# EAGLE board tc08-8-07 (EAGLE 6.6.0), part 1 of 10
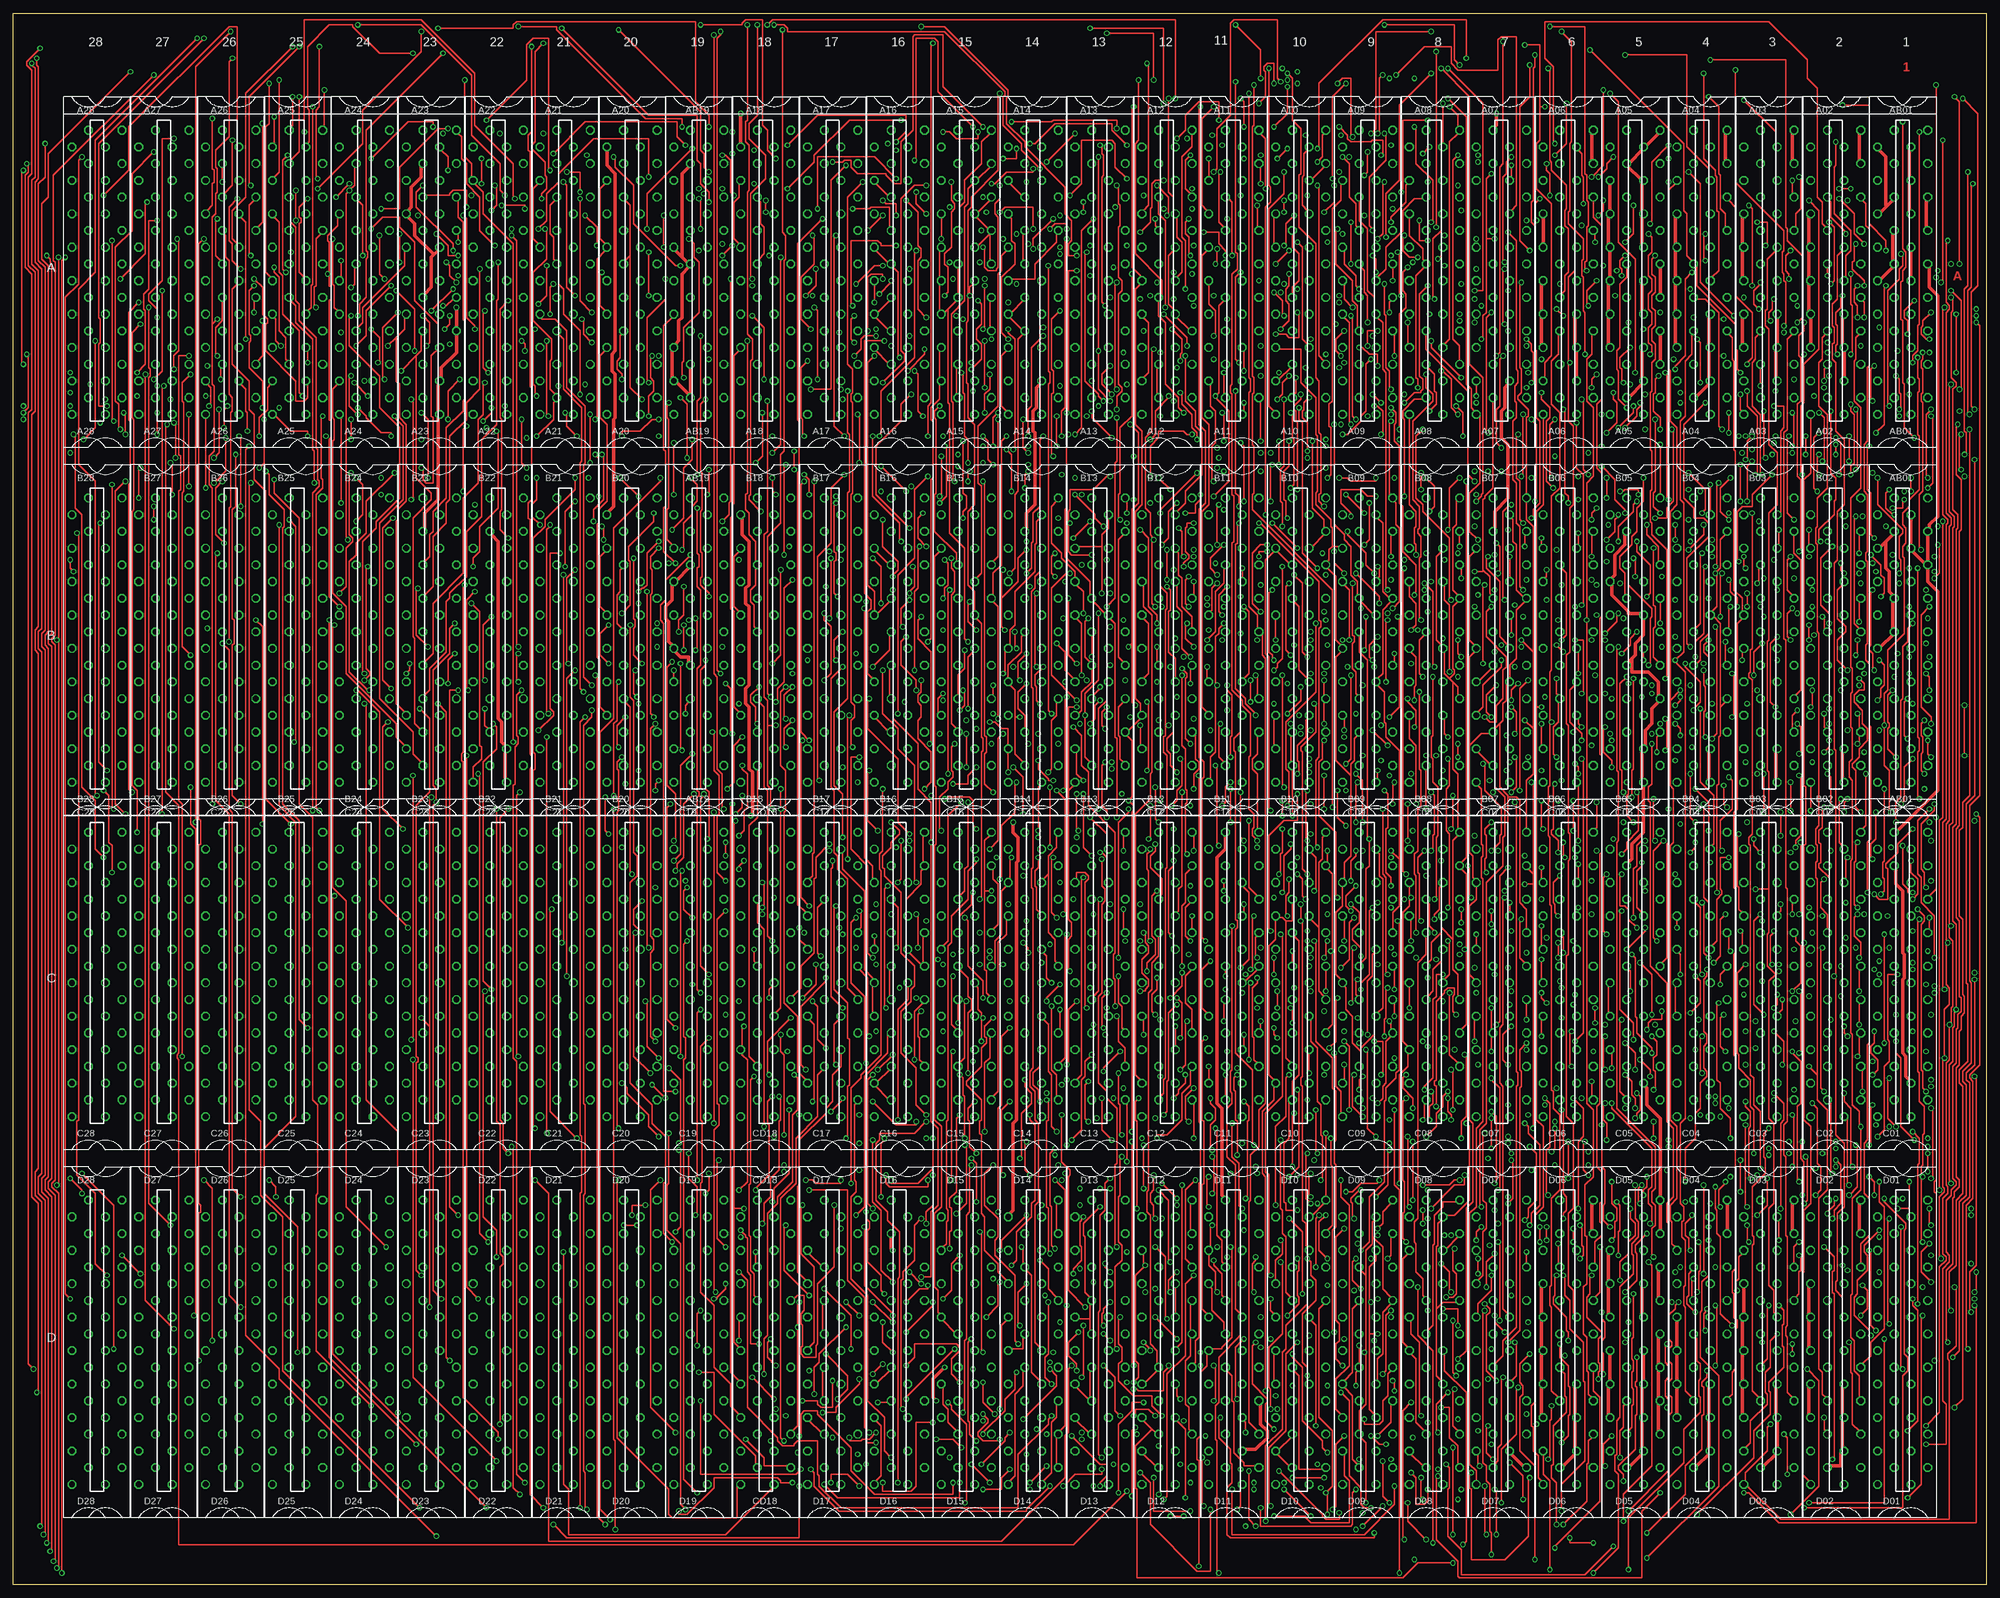
[diagram p12: board, top side]
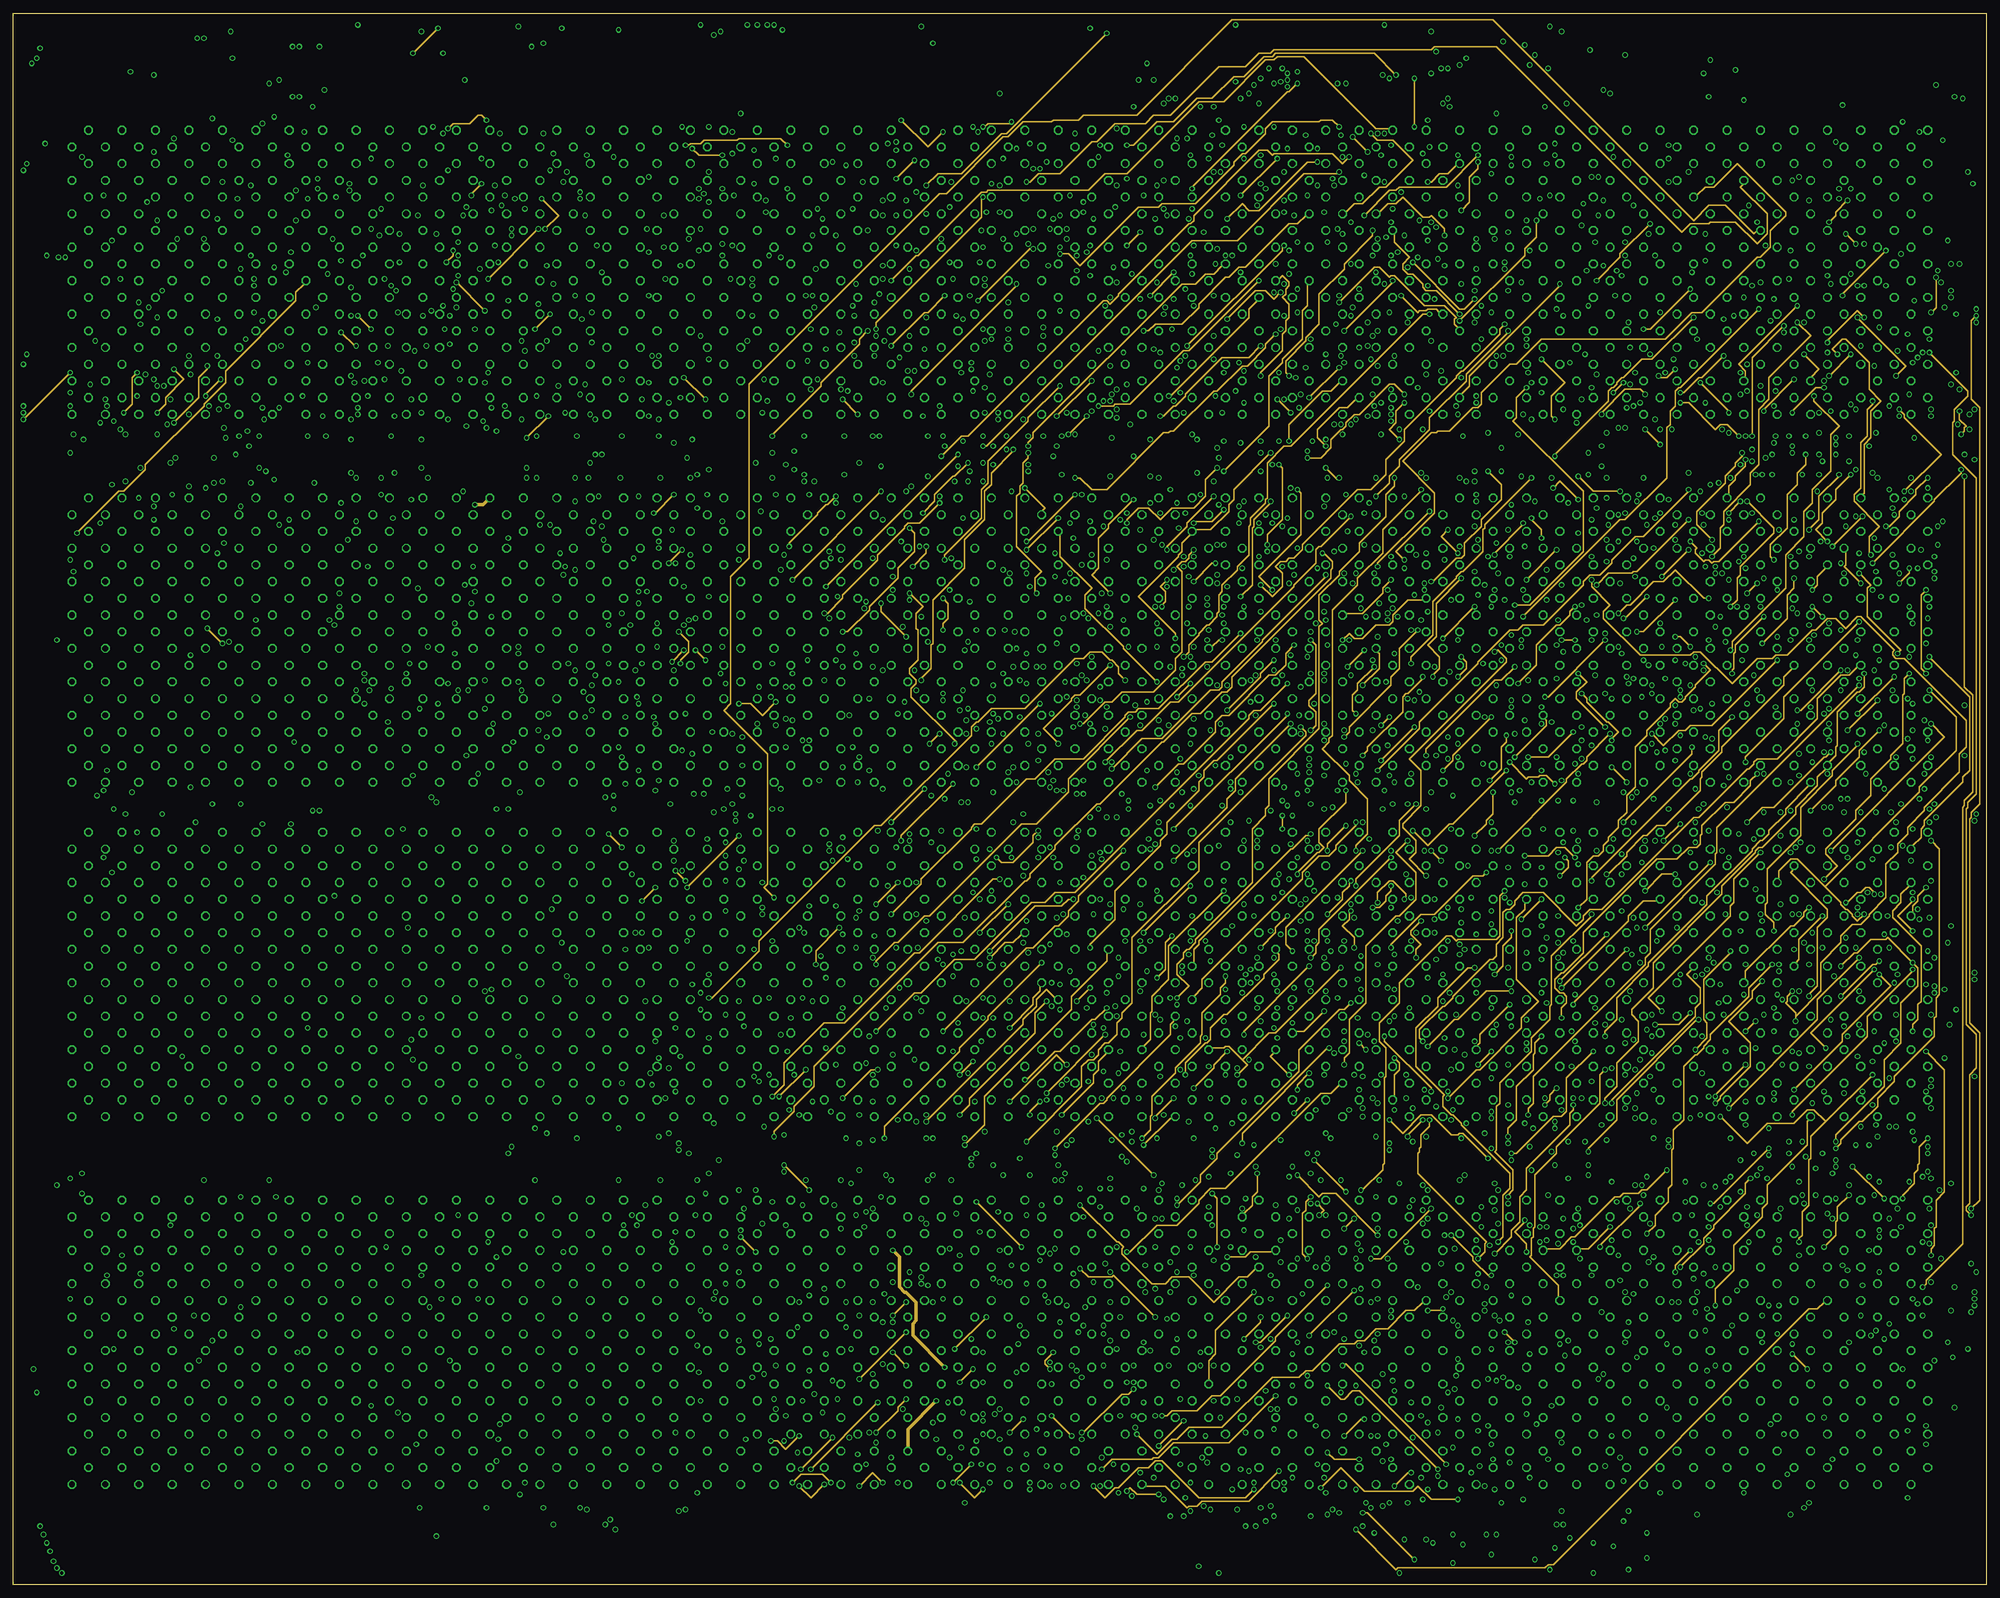
[diagram p13: board, inner layer Route2]
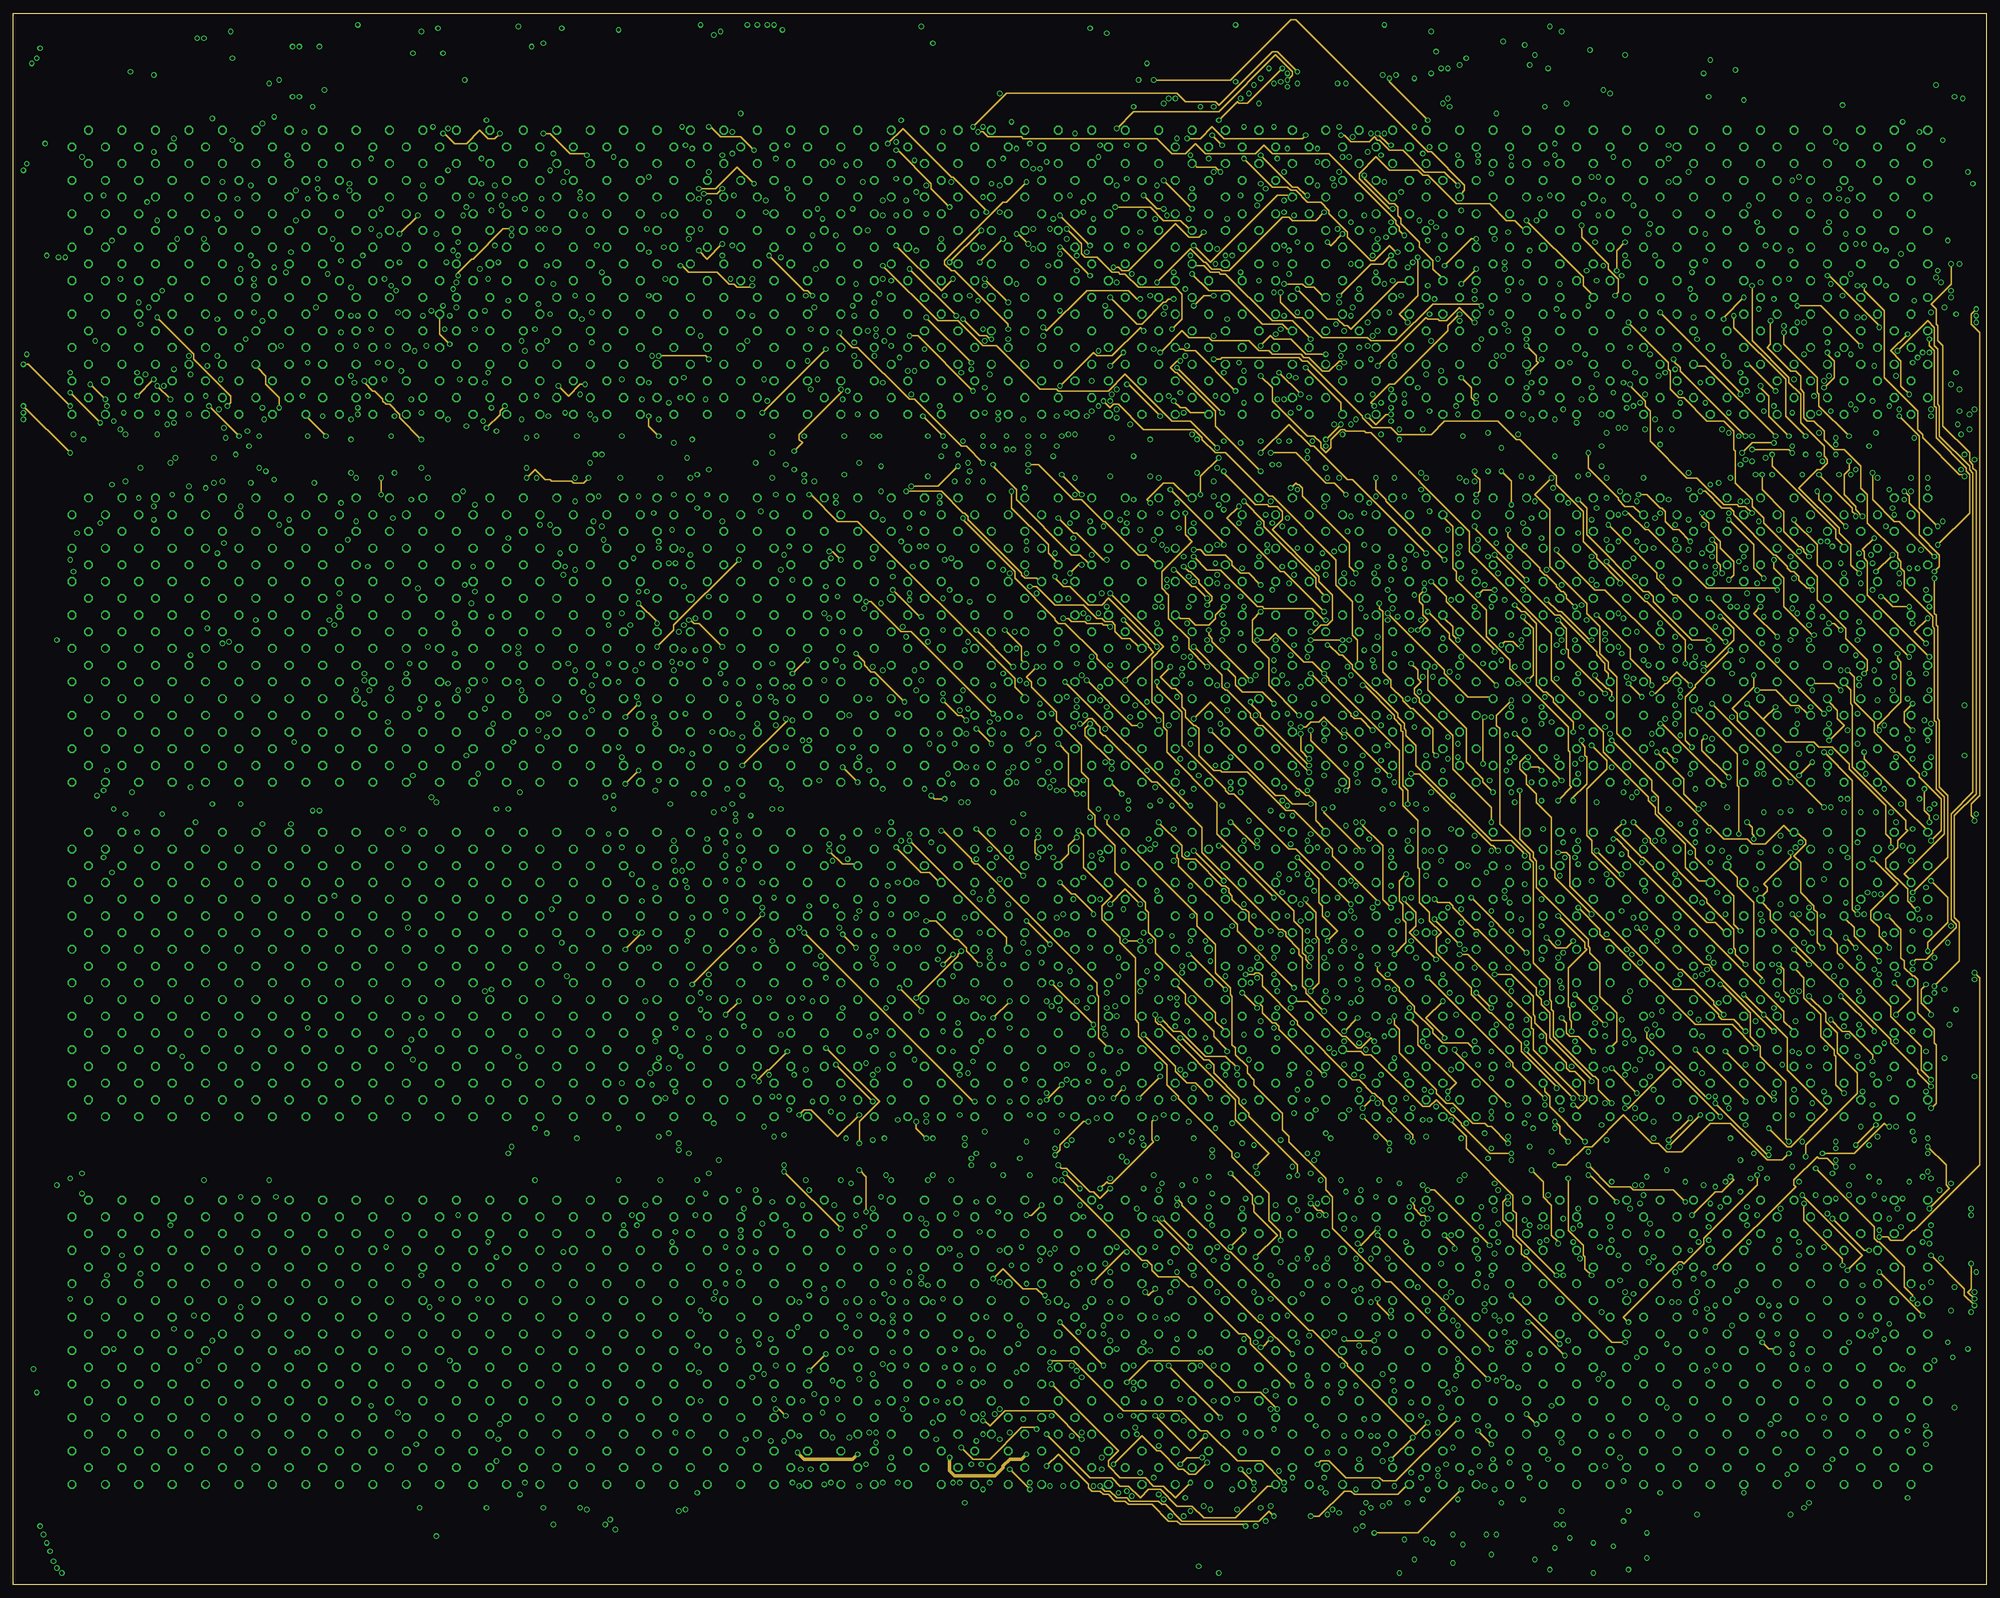
[diagram p14: board, inner layer Route15]
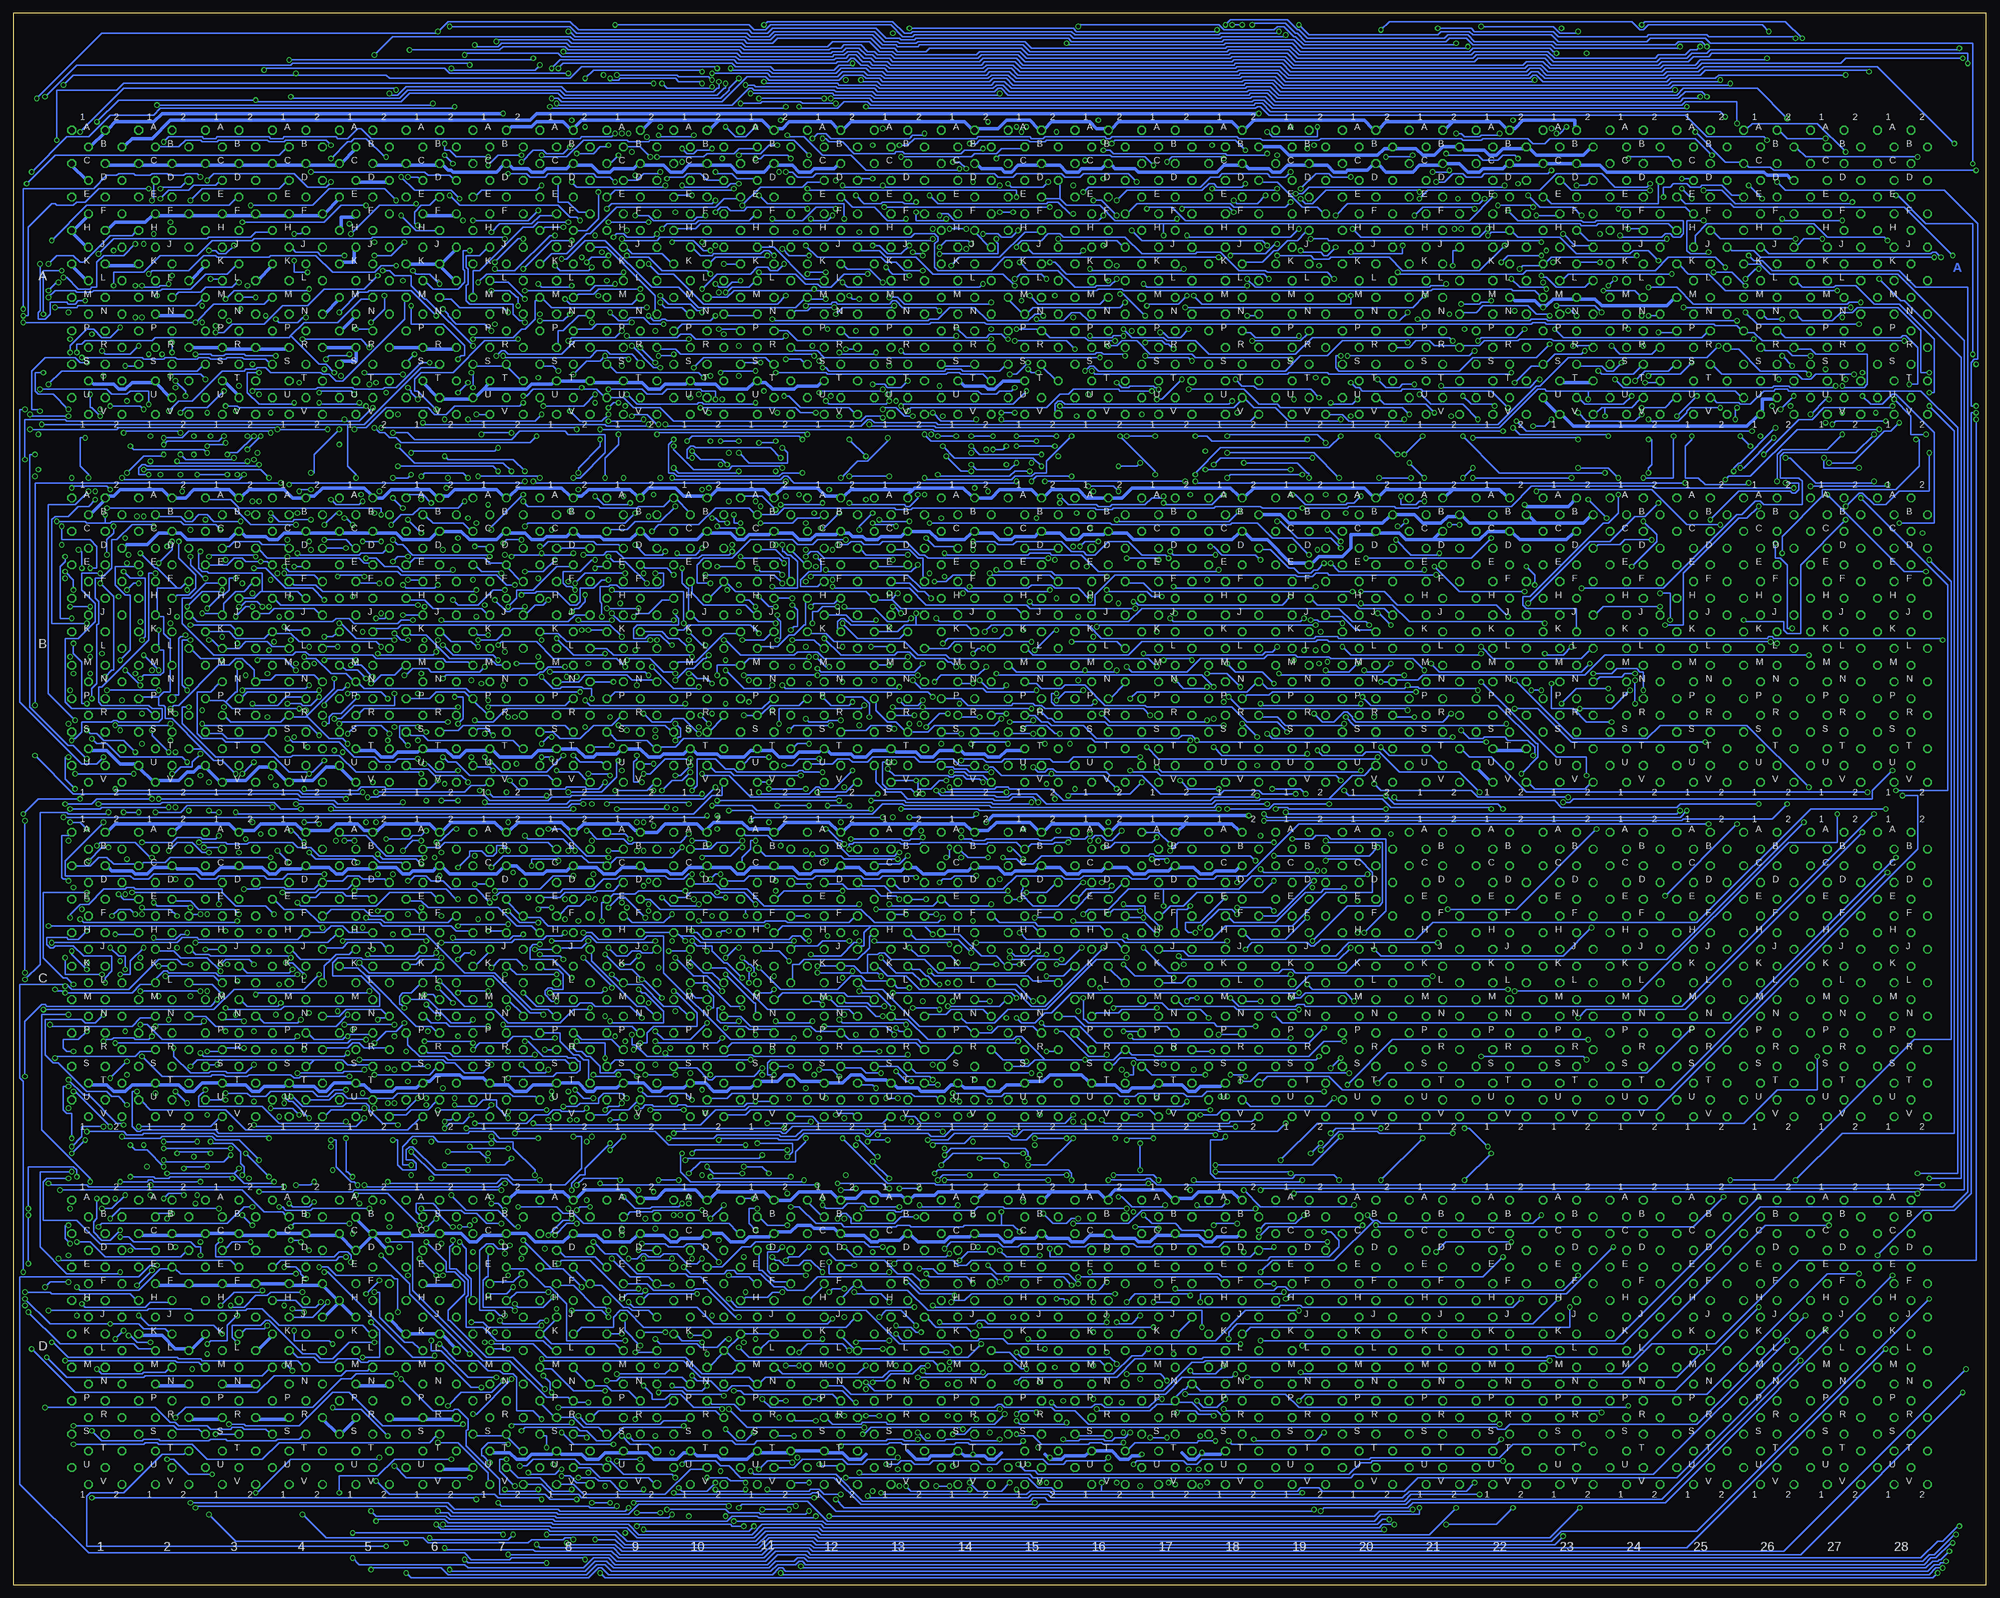
[diagram p15: board, bottom side, seen from below]

Size 374.71 x 298.44 mm. Coordinates in mm from the lower left corner, seen from the top.
Outline: 374.68,0 0,0 0.03,298.42 374.71,298.44 374.68,0
Copper layers (1*2*15*16): Top 0.035mm / dielectric 1.5mm / Route2 0.035mm / dielectric 0.15mm / Route15 0.035mm / dielectric 0.2mm / Bottom 0.035mm
Design rules "10mils": minimum track width 10mil, minimum drill 24mil, track to track 10mil, track to pad 10mil, pad to pad 10mil, via to via 10mil, smd to smd 10mil, copper to edge 40mil, drill to drill 10mil, minimum pad ring 10mil, minimum via ring 8mil, stop-mask expansion 0mil, vias tented up to drill 0mil, thermal gap 10mil
Net classes: 1 Power: width 0.635 mm, drill 0.381 mm, clearance 0.381 mm

## Footprints (pad centres in the part's own frame; a part is rotated, then mirrored left to right if it is on the bottom)
H807 = drill 1.092 octagon: A1 4.763,28.575; A2 -1.587,28.575; B1 1.587,25.4; B2 -4.763,25.4; C1 4.763,22.225; C2 -1.587,22.225; D1 1.587,19.05; D2 -4.763,19.05; E1 4.763,15.875; E2 -1.587,15.875; F1 1.587,12.7; F2 -4.763,12.7; H1 4.763,9.525; H2 -1.587,9.525; J1 1.587,6.35; J2 -4.763,6.35; K1 4.763,3.175; K2 -1.587,3.175; L1 1.587,0; L2 -4.763,0; M1 4.763,-3.175; M2 -1.587,-3.175; N1 1.587,-6.35; N2 -4.763,-6.35; P1 4.763,-9.525; P2 -1.587,-9.525; R1 1.587,-12.7; R2 -4.763,-12.7; S1 4.763,-15.875; S2 -1.587,-15.875; T1 1.587,-19.05; T2 -4.763,-19.05; U1 4.763,-22.225; U2 -1.587,-22.225; V1 1.587,-25.4; V2 -4.763,-25.4
H807-2 = drill 1.092 octagon: AA1 4.763,60.325; AA2 -1.587,60.325; AB1 1.587,57.15; AB2 -4.763,57.15; AC1 4.763,53.975; AC2 -1.587,53.975; AD1 1.587,50.8; AD2 -4.763,50.8; AE1 4.763,47.625; AE2 -1.587,47.625; AF1 1.587,44.45; AF2 -4.763,44.45; AH1 4.763,41.275; AH2 -1.587,41.275; AJ1 1.587,38.1; AJ2 -4.763,38.1; AK1 4.763,34.925; AK2 -1.587,34.925; AL1 1.587,31.75; AL2 -4.763,31.75; AM1 4.763,28.575; AM2 -1.587,28.575; AN1 1.587,25.4; AN2 -4.763,25.4; AP1 4.763,22.225; AP2 -1.587,22.225; AR1 1.587,19.05; AR2 -4.763,19.05; AS1 4.763,15.875; AS2 -1.587,15.875; AT1 1.587,12.7; AT2 -4.763,12.7; AU1 4.763,9.525; AU2 -1.587,9.525; AV1 1.587,6.35; AV2 -4.763,6.35; BA1 4.763,-9.525; BA2 -1.587,-9.525; BB1 1.587,-12.7; BB2 -4.763,-12.7; BC1 4.763,-15.875; BC2 -1.587,-15.875; BD1 1.587,-19.05; BD2 -4.763,-19.05; BE1 4.763,-22.225; BE2 -1.587,-22.225; BF1 1.587,-25.4; BF2 -4.763,-25.4; BH1 4.763,-28.575; BH2 -1.587,-28.575; BJ1 1.587,-31.75; BJ2 -4.763,-31.75; BK1 4.763,-34.925; BK2 -1.587,-34.925; BL1 1.587,-38.1; BL2 -4.763,-38.1; BM1 4.763,-41.275; BM2 -1.587,-41.275; BN1 1.587,-44.45; BN2 -4.763,-44.45; BP1 4.763,-47.625; BP2 -1.587,-47.625; BR1 1.587,-50.8; BR2 -4.763,-50.8; BS1 4.763,-53.975; BS2 -1.587,-53.975; BT1 1.587,-57.15; BT2 -4.763,-57.15; BU1 4.763,-60.325; BU2 -1.587,-60.325; BV1 1.587,-63.5; BV2 -4.763,-63.5

## Placement (x,y rotation side)
A02  M903  [H807]  346.11,247.64 0 top
A03  M903  [H807]  333.41,247.64 0 top
A04  M903  [H807]  320.71,247.64 0 top
A05  M903  [H807]  308.01,247.64 0 top
A06  M903  [H807]  295.31,247.64 0 top
A07  M161  [H807]  282.61,247.64 0 top
A08  M206  [H807]  269.91,247.64 0 top
A09  M117  [H807]  257.21,247.64 0 top
A10  M113  [H807]  244.51,247.64 0 top
A11  M111  [H807]  231.81,247.64 0 top
A12  M113  [H807]  219.11,247.64 0 top
A13  H807  [H807]  206.41,247.64 0 top
A14  M302  [H807]  193.71,247.64 0 top
A15  M627  [H807]  181.01,247.64 0 top
A16  M602  [H807]  168.31,247.64 0 top
A17  H807  [H807]  155.61,247.64 0 top
A18  G888  [H807]  142.91,247.64 0 top
A20  G888  [H807]  117.51,247.64 0 top
A21  G888  [H807]  104.81,247.64 0 top
A22  M502  [H807]  92.11,247.64 0 top
A23  M633  [H807]  79.41,247.64 0 top
A24  W023  [H807]  66.71,247.64 0 top
A25  M916  [H807]  54.01,247.64 0 top
A26  M916  [H807]  41.31,247.64 0 top
A27  H807  [H807]  28.61,247.64 0 top
A28  H807  [H807]  15.91,247.64 0 top
AB01  G821  [H807-2]  358.81,215.89 0 top
AB19  W032  [H807-2]  130.21,215.89 0 top
B02  M623  [H807]  346.11,177.79 0 top
B03  M623  [H807]  333.41,177.79 0 top
B04  M623  [H807]  320.71,177.79 0 top
B05  M623  [H807]  308.01,177.79 0 top
B06  M111  [H807]  295.31,177.79 0 top
B07  M207  [H807]  282.61,177.79 0 top
B08  M113  [H807]  269.91,177.79 0 top
B09  M206  [H807]  257.21,177.79 0 top
B10  M627  [H807]  244.51,177.79 0 top
B11  M115  [H807]  231.81,177.79 0 top
B12  M117  [H807]  219.11,177.79 0 top
B13  M206  [H807]  206.41,177.79 0 top
B14  M206  [H807]  193.71,177.79 0 top
B15  M113  [H807]  181.01,177.79 0 top
B16  M602  [H807]  168.31,177.79 0 top
B17  H807  [H807]  155.61,177.79 0 top
B18  G888  [H807]  142.91,177.79 0 top
B20  G888  [H807]  117.51,177.79 0 top
B21  G879  [H807]  104.81,177.79 0 top
B22  M633  [H807]  92.11,177.79 0 top
B23  W005  [H807]  79.41,177.79 0 top
B24  H807  [H807]  66.71,177.79 0 top
B25  H807  [H807]  54.01,177.79 0 top
B26  H807  [H807]  41.31,177.79 0 top
B27  H807  [H807]  28.61,177.79 0 top
B28  H807  [H807]  15.91,177.79 0 top
C01  M101  [H807]  358.81,114.29 0 top
C02  M101  [H807]  346.11,114.29 0 top
C03  M101  [H807]  333.41,114.29 0 top
C04  M103  [H807]  320.71,114.29 0 top
C05  M103  [H807]  308.01,114.29 0 top
C06  M111  [H807]  295.31,114.29 0 top
C07  M207  [H807]  282.61,114.29 0 top
C08  M121  [H807]  269.91,114.29 0 top
C09  M206  [H807]  257.21,114.29 0 top
C10  M121  [H807]  244.51,114.29 0 top
C11  M113  [H807]  231.81,114.29 0 top
C12  M115  [H807]  219.11,114.29 0 top
C13  M111  [H807]  206.41,114.29 0 top
C14  M206  [H807]  193.71,114.29 0 top
C15  M113  [H807]  181.01,114.29 0 top
C16  M627  [H807]  168.31,114.29 0 top
C17  M111  [H807]  155.61,114.29 0 top
C19  H807  [H807]  130.21,114.29 0 top
C20  H807  [H807]  117.51,114.29 0 top
C21  H807  [H807]  104.81,114.29 0 top
C22  H807  [H807]  92.11,114.29 0 top
C23  H807  [H807]  79.41,114.29 0 top
C24  H807  [H807]  66.71,114.29 0 top
C25  H807  [H807]  54.01,114.29 0 top
C26  H807  [H807]  41.31,114.29 0 top
C27  H807  [H807]  28.61,114.29 0 top
C28  H807  [H807]  15.91,114.29 0 top
CD18  M228  [H807-2]  142.91,82.54 0 top
D01  H807  [H807]  358.81,44.44 0 top
D02  M903  [H807]  346.11,44.44 0 top
D03  M903  [H807]  333.41,44.44 0 top
D04  M903  [H807]  320.71,44.44 0 top
D05  M903  [H807]  308.01,44.44 0 top
D06  M903  [H807]  295.31,44.44 0 top
D07  M161  [H807]  282.61,44.44 0 top
D08  M207  [H807]  269.91,44.44 0 top
D09  M121  [H807]  257.21,44.44 0 top
D10  M119  [H807]  244.51,44.44 0 top
D11  M206  [H807]  231.81,44.44 0 top
D12  M627  [H807]  219.11,44.44 0 top
D13  M602  [H807]  206.41,44.44 0 top
D14  M307  [H807]  193.71,44.44 0 top
D15  M401  [H807]  181.01,44.44 0 top
D16  M302  [H807]  168.31,44.44 0 top
D17  M602  [H807]  155.61,44.44 0 top
D19  H807  [H807]  130.21,44.44 0 top
D20  H807  [H807]  117.51,44.44 0 top
D21  H807  [H807]  104.81,44.44 0 top
D22  H807  [H807]  92.11,44.44 0 top
D23  H807  [H807]  79.41,44.44 0 top
D24  H807  [H807]  66.71,44.44 0 top
D25  H807  [H807]  54.01,44.44 0 top
D26  H807  [H807]  41.31,44.44 0 top
D27  H807  [H807]  28.61,44.44 0 top
D28  H807  [H807]  15.91,44.44 0 top
U$17  [CBLOCK]  9.56,12.69 0 top
U$18  [CBLOCK]  60.36,12.69 0 top
U$19  [CBLOCK]  111.16,12.69 0 top
U$20  [CBLOCK]  161.96,12.69 0 top
U$66  [CBLOCK]  212.76,12.69 0 top
U$67  [CBLOCK]  263.56,12.69 0 top
U$68  [CBLOCK]  314.36,12.69 0 top
U$69  [CBLOCK]  314.36,146.04 0 top
U$70  [CBLOCK]  263.56,146.04 0 top
U$71  [CBLOCK]  212.76,146.04 0 top
U$72  [CBLOCK]  161.96,146.04 0 top
U$73  [CBLOCK]  111.16,146.04 0 top
U$74  [CBLOCK]  60.36,146.04 0 top
U$75  [CBLOCK]  9.56,146.04 0 top

## Tracks (layer width: path | path; a pad name or v marks a point on that pad's centre or on a via)
0_TO_DTB  (via drill 0.61)
  Top 0.254: v233.72,104.44 233.72,102.22 C11.R1 | v212.76,206.05 v212.76,214.3 | v215.94,217.48 216.89,218.43 216.89,222.87 219.43,225.41 v219.43,225.73
  Route2 0.254: v233.72,104.44 233.72,105.08 v246.1,117.46 | v208.32,188.27 204.82,191.76 206.09,193.03 206.09,198.74 208,200.65 208,201.28 v212.76,206.05 | v219.43,225.73 219.75,225.73 234.67,240.65 234.67,242.24 236.26,243.83 A11.M1
  Route15 0.254: v246.1,117.46 246.1,118.1 245.46,118.73 245.46,119.37 244.83,120 244.83,124.45 243.24,126.03 243.24,127.94 228.64,142.55 228.64,148.58 219.11,158.1 219.11,162.23 218.48,162.86 218.48,165.4 216.25,167.63 216.25,175.88 218.48,178.11 v208.32,188.27
  Bottom 0.254: v212.76,214.3 v215.94,217.48
0_TO_EF  (via drill 0.61)
  Top 0.254: v231.49,252.4 231.49,262.56 230.86,263.19 A11.E2
  Bottom 0.254: v231.49,252.4 231.81,252.08 241.34,252.08 242.29,251.13 A10.K2
0_TO_STA
  Bottom 0.254: A11.N1 234.03,240.97 239.11,240.97 A10.N2
1_TO_DF  (via drill 0.61)
  Top 0.254: v231.18,64.12 231.49,63.81 231.49,46.98 229.59,45.07 229.59,44.75 227.68,44.75 D11.L2 226.73,43.8 226.73,41.58 225.46,40.31 225.46,28.25 224.83,27.61 224.83,23.8 225.14,23.48 v225.14,3.48 | v233.4,71.43 232.76,72.06 232.76,80 231.49,81.27 v231.49,87.62 | v223.24,87.94 222.6,88.57 222.6,92.7 v224.19,94.28 | C12.J1 220.38,120 220.38,114.92 C12.L1 | v270.23,291.13 v270.23,257.8 | v22.26,287.32 6.7,271.77 6.7,263.51 5.43,262.24 5.43,251.77 6.7,250.49 6.7,180.96 6.07,180.33 6.07,178.42 6.7,177.79 6.7,77.46 6.07,76.82 6.07,74.92 7.34,73.65 7.34,6.66 v7.02,6.34
  Route2 0.254: v224.19,94.28 228,98.1 228,98.73 v230.54,101.27
  Route15 0.254: v231.18,64.12 234.03,66.98 v233.72,67.3 | v230.54,101.27 230.54,101.59 228,104.13 228,105.08 222.6,110.48 222.6,112.07 221.02,113.65 C12.L1
  Bottom 0.254: v233.72,67.3 234.99,68.57 234.99,71.43 v233.4,71.43 | v231.49,87.62 223.56,87.62 v223.24,87.94 | v270.23,257.8 273.72,257.8 274.04,257.48 A08.H1 | v270.23,291.13 269.91,290.82 237.21,290.82 236.57,290.18 219.11,290.18 218.79,290.5 216.89,290.5 216.25,291.13 214.35,291.13 213.08,289.86 211.81,289.86 211.17,289.23 208.63,289.23 208,288.6 190.85,288.6 190.22,289.23 184.5,289.23 183.23,287.96 142.59,287.96 142.28,288.28 134.02,288.28 132.43,286.69 87.03,286.69 86.4,287.32 85.13,287.32 83.86,286.05 61,286.05 60.36,286.69 54.33,286.69 53.38,287.64 22.58,287.64 v22.26,287.32 | v7.02,6.34 8.61,4.75 8.93,4.75 9.24,4.43 10.2,4.43 11.47,3.16 224.83,3.16 v225.14,3.48
1_TO_DTF  (via drill 0.61)
  Top 0.254: v216.89,32.06 215.62,33.32 213.08,33.32 213.08,32.37 v212.76,32.06 | v210.22,32.06 209.27,33.01 209.27,39.36 v207.05,41.58 | v167.04,49.83 v163.23,53.64 | v151.17,54.92 146.4,59.68 146.4,67.93 v146.72,68.25 | v142.28,68.57 142.59,68.88 142.59,72.38 143.86,73.65 143.86,77.14 145.45,78.73 145.45,87.94 145.77,88.25 145.77,92.38 v145.45,92.7 | v150.53,97.78 149.58,98.73 149.58,109.84 154.34,114.61 v154.34,115.24
  Route2 0.254: v145.45,92.7 v150.53,97.78 | v163.87,117.78 163.87,118.41 167.36,121.91 167.99,121.91 173.07,126.99 174.03,126.99 191.49,144.45 194.35,144.45 200.38,150.48 200.38,153.02 v212.13,164.77
  Route15 0.254: v226.41,28.25 223.56,25.39 v216.89,32.06 | v207.05,41.58 v198.79,49.83
  Bottom 0.254: v226.41,28.25 229.59,28.25 D11.S2 | v212.76,32.06 v210.22,32.06 | v198.79,49.83 198.47,49.52 192.12,49.52 191.49,50.15 190.22,50.15 189.58,49.52 167.36,49.52 v167.04,49.83 | v163.23,53.64 161.64,55.23 151.48,55.23 v151.17,54.92 | v146.72,68.25 146.4,68.57 v142.28,68.57 | v154.34,115.24 154.66,115.56 161.64,115.56 v163.87,117.78 | v212.13,164.77 212.13,167.31 213.4,168.58 216.89,168.58 B12.P2
76  (via drill 0.61)
  Top 0.254: v306.11,96.83 307.38,95.55 307.38,93.02 308.01,92.38 v308.01,90.47
  Bottom 0.254: v306.11,96.83 295.63,96.83 294.36,98.1 C06.S2 | v308.01,90.47 308.33,90.16 314.36,90.16 315.31,89.21 C04.V2
76+77  (via drill 0.61)
  Top 0.254: v240.38,21.58 248.64,13.32 248.64,13.01 249.27,12.37 251.81,12.37 v251.81,13.64 | v340.08,72.38 340.71,73.01 340.71,80.95 v340.4,81.27
  Route2 0.254: v240.38,21.58 234.67,15.86 225.78,15.86 224.83,14.91 223.24,14.91 222.92,14.59 218.79,18.72 214.98,18.72 D12.V2 | v256.26,13.64 257.21,13.64 v266.1,4.75 | v341.03,111.75 341.03,112.07 342.62,113.65 342.62,124.77 344.52,126.67 344.52,128.26 337.54,135.24 338.17,135.88 C03.C1
  Route15 0.254: v347.38,60.63 347.38,61.9 340.08,69.2 v340.08,72.38 | v340.4,81.27 340.4,83.49 350.24,93.33 350.24,97.14 346.43,100.95 346.43,104.76 344.21,106.99 344.21,108.57 v341.03,111.75
  Bottom 0.254: v251.81,13.64 v256.26,13.64 | v266.1,4.75 266.42,5.07 280.07,5.07 280.39,4.75 287.69,4.75 288.96,6.02 360.4,6.02 373.42,19.04 373.42,58.41 350.87,58.41 348.65,60.63 v347.38,60.63
77
  Bottom 0.254: C06.U2 294.36,91.74 295.95,90.16 299.12,90.16 300.07,89.21 302.61,89.21 C05.V2
!00  (via drill 0.61)
  Top 0.254: v89.57,166.36 89.57,163.18 90.21,162.55 B22.S2 | v53.38,160.01 53.69,160.33 53.69,200.96 v52.42,202.24 | v38.14,209.22 40.36,211.44 v40.36,217.79 | v46.71,212.08 47.66,213.03 v47.66,221.29 | v47.34,223.51 47.34,228.59 44.8,231.13 44.8,235.89 45.12,236.21 45.12,237.16 44.8,237.48 44.8,245.73 v45.76,246.68 | v51.79,249.23 51.15,249.86 51.15,270.5 v52.11,271.45 | v206.41,273.36 206.73,273.04 206.73,271.77 207.05,271.45 207.05,267.64 206.73,267.32 206.73,243.51 v207.36,242.87 | v218.48,241.29 222.92,236.84 v222.92,235.26 | v241.34,254.3 241.65,254.62 241.65,258.43 v243.24,260.02 | v284.52,269.55 284.52,267.32 A07.D1
  Route2 0.254: v222.92,235.26 241.02,253.35 241.02,253.99 v241.34,254.3 | v256.58,260.02 261.34,264.78 262.61,264.78 263.24,265.42 272.13,265.42 v278.17,271.45
  Bottom 0.254: v89.57,166.36 85.13,166.36 78.78,160.01 v53.38,160.01 | v52.42,202.24 47.03,207.63 37.18,207.63 36.87,207.31 36.23,207.31 35.6,207.95 35.6,209.22 v38.14,209.22 | v40.36,217.79 46.07,212.08 v46.71,212.08 | v47.66,221.29 47.66,223.51 v47.34,223.51 | v45.76,246.68 48.3,249.23 v51.79,249.23 | v52.11,271.45 55.28,274.62 82.9,274.62 83.86,273.67 86.08,273.67 87.03,274.62 95.6,274.62 95.92,274.31 99.41,274.31 99.73,274.62 126.4,274.62 126.72,274.31 137.51,274.31 137.83,274.62 141.96,274.62 142.28,274.94 166.09,274.94 166.41,274.62 167.04,274.62 167.36,274.94 178.79,274.94 179.11,274.62 181.33,274.62 181.65,274.94 191.49,274.94 191.81,274.62 203.55,274.62 204.82,273.36 v206.41,273.36 | v207.36,242.87 207.68,242.56 217.21,242.56 v218.48,241.29 | v243.24,260.02 243.56,259.7 244.83,259.7 245.46,259.07 253.08,259.07 254.04,260.02 v256.58,260.02 | v278.17,271.45 282.61,271.45 v284.52,269.55
!0_TO_AC  (via drill 0.61)
  Top 0.254: v290.23,163.5 290.23,159.37 B06.T2 | v312.77,182.55 B05.H1
  Route2 0.254: v290.87,168.58 291.5,168.58 v302.3,179.37
  Bottom 0.254: v290.23,163.5 289.28,164.45 289.28,168.58 v290.87,168.58 | v302.3,179.37 302.61,179.69 309.6,179.69 312.46,182.55 v312.77,182.55
!0_TO_DTB  (via drill 0.61)
  Top 0.254: C09.K2 255.94,118.1 256.89,119.05 256.89,135.88 257.53,136.51 v257.53,141.59 257.21,141.91 257.21,175.56 255.62,177.15 B09.K2 255.94,181.6 v255.94,185.41 | v261.97,185.41 263.24,186.68 263.24,200.65 262.61,201.28 262.61,205.41 262.29,205.73 B09.A1 261.34,206.68 261.34,220.65 v261.66,220.97 | v239.43,245.42 241.02,243.83 241.02,241.29 v241.34,240.97 | v254.04,240.97 254.35,240.65 254.35,221.92 v254.99,221.29
  Bottom 0.254: v257.53,141.59 258.48,142.55 261.34,142.55 C09.A1 | B10.L1 246.73,178.11 248.32,179.69 250.23,179.69 251.5,180.96 B09.K2 | v255.94,185.41 v261.97,185.41 | v239.43,245.42 239.11,245.42 238.16,246.37 234.99,246.37 234.03,247.32 A11.L1 | v241.34,240.97 242.29,240.02 250.54,240.02 250.86,240.33 251.5,240.33 251.81,240.02 253.08,240.02 v254.04,240.97 | v254.99,221.29 255.31,220.97 v261.66,220.97
!0_TO_EF  (via drill 0.61)
  Top 0.254: v228,280.66 225.78,278.43 225.78,261.93 226.73,260.97 A11.F2 | v272.77,280.66 274.36,279.07 274.36,276.85 A08.A1 274.36,275.58 272.77,273.99 272.77,236.52 271.82,235.57 A08.R1
  Bottom 0.254: A08.R1 271.18,235.57 271.18,238.11 270.23,238.11 267.37,240.97 265.78,240.97 A08.N2 | v228,280.66 228.32,280.34 272.45,280.34 v272.77,280.66
!0_TO_LPB
  Top 0.254: D08.A1 274.04,72.69 271.5,72.69 271.5,71.74 269.91,70.16 269.91,64.76 269.59,64.44 269.59,49.2 268.64,48.25 D08.K2
  Bottom 0.254: D12.J2 214.98,50.47 216.57,48.88 254.99,48.88 258.16,52.06 259.43,52.06 260.7,50.79 260.7,48.88 266.74,48.88 267.69,47.93 D08.K2
!0_TO_STA  (via drill 0.61)
  Top 0.254: 288.64,162.55 v287.06,164.14 | 288.64,162.55 288.64,153.98 287.37,152.71 C07.A1 | 288.64,177.15 v286.42,179.37 | 288.64,177.15 288.64,162.55 | 288.64,177.15 288.64,200.96 287.37,202.24 B07.A1 287.37,221.6 287.69,221.92 287.69,223.19 285.79,225.09 285.79,225.73 286.42,226.36 286.42,230.81 286.1,231.13 286.1,247 v286.42,247.32 | v240.7,238.43 242.29,240.02 242.29,243.19 241.65,243.83 241.65,246.05 242.29,246.68 v242.29,248.91 | v258.16,252.4 258.8,251.77 v258.8,249.23
  Bottom 0.254: v287.06,164.14 286.74,163.82 283.56,163.82 281.02,166.36 232.45,166.36 230.86,167.95 B11.P2 | v286.42,179.37 282.93,179.37 281.66,180.64 B07.K2 | v240.7,238.43 237.21,238.43 A11.P1 | v242.29,248.91 242.92,249.54 251.5,249.54 254.04,252.08 257.85,252.08 v258.16,252.4 | v258.8,249.23 259.12,248.91 284.83,248.91 v286.42,247.32
!0_TO_STATE  (via drill 0.61)
  Top 0.254: v167.99,88.25 167.99,109.21 169.9,111.11 C16.L1
  Bottom 0.254: v167.99,88.25 167.36,87.62 143.86,87.62 143.55,87.94 139.42,87.94 138.78,88.57 CD18.AV2
!0_TO_W  (via drill 0.61)
  Top 0.254: v140.69,96.51 140.05,95.87 140.05,76.19 139.74,75.87 139.74,66.35 140.05,66.03 140.05,59.68 140.69,59.04 140.69,54.92 141.01,54.6 CD18.BH2 | v143.55,96.83 143.23,97.14 143.23,103.18 v147.67,107.62 | v165.77,109.52 165.45,109.84 165.45,132.07 v166.09,132.7
  Bottom 0.254: v140.69,96.51 141.01,96.83 v143.55,96.83 | v147.67,107.62 149.26,109.21 155.29,109.21 156.56,110.48 159.1,110.48 159.74,109.84 165.45,109.84 v165.77,109.52 | v166.09,132.7 166.72,132.07 170.85,132.07 172.44,130.48 C16.E1
!01  (via drill 0.61)
  Top 0.254: v176.88,244.78 177.52,245.42 177.52,250.18 176.88,250.81 176.88,252.72 178.15,253.99 178.15,260.66 178.79,261.29 178.79,262.24 178.15,262.88 v178.15,266.37 | v185.77,266.05 186.41,266.05 188.63,268.28 193.71,268.28 v193.71,268.91 | v201.65,275.58 v196.25,270.18
  Route2 0.254: v166.72,235.26 173.07,241.61 173.71,241.61 v176.88,244.78
  Route15 0.254: v82.9,235.57 81,237.48 A23.N1 | v122.59,233.35 131.48,233.35 v132.12,232.71 | v222.92,274.62 225.46,274.62 227.68,276.85 229.91,274.62 244.83,274.62 v245.46,275.26 | v252.13,275.26 252.77,275.26 254.04,273.99 257.53,273.99 258.48,274.94 259.12,274.31 259.43,274.31 261.34,272.4 263.88,272.4 268.01,268.28 271.82,268.28 v274.36,265.74
  Bottom 0.254: v82.9,235.57 85.44,233.03 97.51,233.03 100.05,230.49 122.91,230.49 123.54,231.13 123.54,233.35 v122.59,233.35 | v132.12,232.71 132.43,233.03 150.21,233.03 150.85,233.67 158.79,233.67 161.33,236.21 164.18,236.21 165.14,235.26 v166.72,235.26 | v178.15,266.37 179.11,265.42 185.14,265.42 v185.77,266.05 | v193.71,268.91 194.98,270.18 v196.25,270.18 | v201.65,275.58 201.97,275.26 203.87,275.26 204.51,274.62 219.43,274.62 220.38,275.58 221.97,275.58 v222.92,274.62 | v245.46,275.26 245.78,274.94 251.81,274.94 v252.13,275.26 | v274.36,265.74 275.31,264.78 285.79,264.78 286.74,263.83 A07.E1
!02  (via drill 0.61)
  Top 0.254: v77.82,265.74 76.55,264.47 76.55,261.61 83.54,254.62 v83.54,253.35 | v82.27,251.13 82.9,250.49 82.9,248.59 v84.17,247.32 | v89.57,241.92 89.25,241.61 89.25,231.13 v90.21,230.18 | v169.9,230.49 173.07,233.67 v173.07,234.62 | v184.5,227.32 v184.5,236.21 | v208.63,226.05 206.73,227.95 206.73,229.86 v208.32,231.45 | v255.62,234.94 256.26,234.94 257.53,233.67 259.12,233.67 v259.12,231.45
  Route2 0.254: v83.54,253.35 83.54,252.4 v82.27,251.13 | v89.57,241.92 v84.17,247.32
  Route15 0.254: v210.86,233.99 v208.32,231.45 | v217.84,233.99 221.97,238.11 223.24,236.84 227.05,236.84 227.68,236.21 234.67,236.21 236.57,234.3 238.48,234.3 239.11,233.67 244.51,233.67 245.15,233.03 246.1,233.03 248.64,230.49 249.91,230.49 251.81,232.4 252.45,232.4 v252.77,232.08 | v259.12,231.45 268.32,240.65 268.64,240.33 270.55,240.33 270.86,240.02 272.13,240.02 274.67,242.56 v277.53,239.7
  Bottom 0.254: v77.82,265.74 75.92,265.74 75.28,266.37 A23.D2 | v90.21,230.18 90.52,229.86 124.81,229.86 125.13,230.18 132.43,230.18 132.75,229.86 169.26,229.86 v169.9,230.49 | v173.07,234.62 174.66,236.21 v184.5,236.21 | v184.5,227.32 185.14,226.68 187.36,226.68 188,226.05 190.85,226.05 191.49,226.68 208,226.68 v208.63,226.05 | v210.86,233.99 211.17,233.67 217.52,233.67 v217.84,233.99 | v255.62,234.94 v252.77,232.08 | v277.53,239.7 277.85,240.02 278.48,240.02 279.75,241.29 279.75,243.19 288.01,243.19 288.64,243.83 288.64,246.68 288.33,247 288.33,249.86 288.64,250.18 288.64,252.4 286.1,252.4 284.83,253.67 A07.J1
!03  (via drill 0.61)
  Top 0.254: v86.08,261.61 86.08,264.78 83.54,264.78 82.9,264.15 82.9,263.83 78.46,263.83 A23.E2 | v92.75,261.93 97.19,261.93 v97.19,261.29 | v108.62,260.02 110.84,257.8 v110.84,254.3 | v120.69,244.78 v120.69,253.04 | v150.53,244.78 152.44,246.68 v152.44,249.86 | v283.88,245.73 283.88,241.92 A07.N1
  Route2 0.254: v230.54,240.33 235.94,245.73 237.84,245.73 239.43,244.14 v240.7,245.42
  Route15 0.254: v179.11,240.97 v170.22,249.86 | v240.7,245.42 240.7,243.51 243.56,240.65 244.83,240.65 248.64,236.84 257.21,236.84 257.85,236.21 262.61,236.21 269.59,243.19 278.48,243.19 v278.8,242.87
  Bottom 0.254: v86.08,261.61 86.4,261.93 v92.75,261.93 | v97.19,261.29 97.51,261.61 107.03,261.61 v108.62,260.02 | v110.84,254.3 110.84,252.72 120.37,252.72 v120.69,253.04 | v120.69,244.78 120.69,243.19 148.94,243.19 v150.53,244.78 | v152.44,249.86 152.75,249.54 169.9,249.54 v170.22,249.86 | v179.11,240.97 179.42,241.29 180.69,241.29 181.96,240.02 189.58,240.02 192.12,242.56 196.89,242.56 199.11,240.33 200.7,240.33 201.01,240.02 230.22,240.02 v230.54,240.33 | v278.8,242.87 278.8,244.46 279.12,244.46 280.39,245.73 v283.88,245.73
!04  (via drill 0.61)
  Top 0.254: v73.38,256.53 v73.38,251.13 | v88.94,270.81 v88.94,266.05 | v102.59,271.77 108.62,277.8 126.08,277.8 126.08,274.94 v127.67,273.36 | v147.04,273.36 152.75,279.07 169.58,279.07 169.58,275.9 v167.68,273.99 | v193.08,273.67 194.03,273.67 197.84,277.48 208.63,277.48 208.63,276.21 v211.49,273.36 | v262.61,286.69 268.01,292.09 273.09,292.09 273.09,288.91 274.36,287.64 281.98,287.64 281.98,293.36 282.61,293.99 285.47,293.99 285.47,261.93 284.52,260.97 A07.F1
  Route2 0.254: v87.03,263.83 87.03,264.15 v88.94,266.05 | v127.67,273.36 128.31,273.36 128.62,273.67 130.53,273.67 131.16,274.31 137.51,274.31 137.83,274.62 145.77,274.62 v147.04,273.36 | v211.49,273.36 212.76,273.36 217.21,277.8 220.38,277.8 224.83,282.24 227.68,282.24 231.81,286.37 233.72,286.37 237.53,290.18 239.11,290.18 239.75,290.82 258.48,290.82 v262.61,286.69
  Route15 0.254: v76.87,260.02 v73.38,256.53
  Bottom 0.254: v73.38,251.13 77.19,251.13 A23.K2 | v76.87,260.02 78.46,261.61 84.81,261.61 v87.03,263.83 | v88.94,270.81 89.57,271.45 91.79,271.45 92.75,270.5 95.6,270.5 96.56,271.45 102.27,271.45 v102.59,271.77 | v167.68,273.99 167.99,274.31 178.47,274.31 178.79,273.99 181.65,273.99 181.96,274.31 191.17,274.31 191.81,273.67 v193.08,273.67
!05  (via drill 0.61)
  Top 0.254: v269.28,258.75 269.59,259.07 269.59,266.69 266.42,269.86 266.42,276.53 v266.1,276.85 | v182.28,276.85 175.61,283.51 175.61,293.04 174.98,293.68 171.49,293.68 171.49,270.81 v171.17,270.5 | v167.68,267 163.55,271.13 152.75,271.13 v152.75,261.29 | v142.91,260.66 v142.91,262.88 | v136.88,263.83 136.24,264.47 136.24,270.5 135.29,271.45 v134.66,271.45 | v128.94,272.72 120.37,264.15 v120.37,257.48
  Route2 0.254: v266.1,286.05 v266.1,276.85 | v171.17,270.5 v167.68,267 | v134.66,271.45 130.21,271.45 v128.94,272.72
  Route15 0.254: v243.88,287.32 240.07,291.13 239.11,291.13 228.95,280.98 228.32,281.61 222.6,281.61 221.02,283.2 188.63,283.2 v182.28,276.85 | v94.65,257.48 93.06,257.48 87.35,251.77 87.03,251.77 84.17,248.91 v84.49,248.59
  Bottom 0.254: v269.28,258.75 274.99,258.75 275.94,257.8 277.85,257.8 286.1,249.54 287.37,249.54 A07.M1 | v266.1,286.05 264.51,287.64 244.19,287.64 v243.88,287.32 | v152.75,261.29 152.44,261.61 143.86,261.61 v142.91,260.66 | v142.91,262.88 142.28,262.24 138.47,262.24 v136.88,263.83 | v120.37,257.48 118.78,255.89 96.24,255.89 v94.65,257.48 | v84.49,248.59 84.17,248.27 83.54,248.27 81.63,246.37 76.24,246.37 75.28,247.32 A23.L2
!06  (via drill 0.61)
  Top 0.254: v78.46,235.26 79.09,235.89 79.09,239.7 v77.82,240.97 | v83.54,246.05 v79.41,241.92 | v99.73,257.48 101.32,259.07 101.32,264.15 103.54,266.37 103.54,267.96 110.21,274.62 120.69,274.62 v120.69,267.32 | v165.14,262.88 165.77,262.24 167.68,262.24 v167.68,260.02 | v214.03,256.85 215.94,258.75 215.94,261.29 216.25,261.61 216.25,266.05 216.89,266.69 v218.48,266.69 | v241.34,262.88 v241.34,260.66
  Route2 0.254: v99.73,257.48 v90.21,247.96 | v214.03,256.85 v211.49,254.3
  Route15 0.254: v130.21,265.1 133.39,265.1 137.51,269.23 v140.69,266.05 | v204.51,254.3 v198.79,260.02 | v223.87,261.29 v218.48,266.69 | v261.97,261.29 261.34,261.29 255.62,267 255.62,267.96 258.8,271.13 261.34,268.59 266.74,268.59 267.69,267.64 268.64,267.64 274.04,262.24 280.39,262.24 283.56,259.07 285.15,259.07 286.74,257.48 A07.H1
  Bottom 0.254: v78.46,235.26 75.28,235.26 A23.R2 | v77.82,240.97 78.78,241.92 v79.41,241.92 | v83.54,246.05 83.86,246.37 88.62,246.37 v90.21,247.96 | v120.69,267.32 124.18,267.32 124.81,267.96 127.35,267.96 v130.21,265.1 | v140.69,266.05 141.32,265.42 146.09,265.42 146.72,266.05 147.67,266.05 148.94,264.78 163.23,264.78 v165.14,262.88 | v167.68,260.02 168.63,259.07 195.93,259.07 197.2,260.34 198.47,260.34 v198.79,260.02 | v204.51,254.3 206.09,252.72 208.63,252.72 210.22,254.3 v211.49,254.3 | v223.87,261.29 224.19,261.61 235.3,261.61 235.94,260.97 238.48,260.97 239.11,261.61 240.38,261.61 v241.34,260.66 | v241.34,262.88 241.97,262.24 261.02,262.24 v261.97,261.29
!07  (via drill 0.61)
  Top 0.254: v69.25,232.08 69.57,232.4 69.57,236.84 v67.98,238.43 | v65.44,240.97 65.76,241.29 65.76,243.19 67.03,244.46 67.03,251.77 67.35,252.08 67.35,253.04 67.03,253.35 67.03,276.21 v81.63,290.82 | v174.66,292.72 174.34,292.41 174.34,224.46 173.71,223.83 v173.71,218.11 | v239.75,237.48 241.65,237.48 242.29,236.84 244.19,236.84 244.19,241.29 v243.88,241.61
  Route2 0.254: v65.44,240.97 v67.98,238.43 | v201.65,210.17 202.6,210.17 204.82,207.95 207.68,207.95 218.48,218.74 219.43,218.74 219.75,219.06 220.38,219.06 228,226.68 228.64,226.68 233.4,231.45 234.35,231.45 237.84,234.94 237.84,235.57 v239.75,237.48 | v265.78,251.13 274.67,242.24 275.63,242.24 v277.53,244.14
  Route15 0.254: v251.81,244.78 257.85,250.81 260.07,250.81 v261.66,252.4
  Bottom 0.254: v69.25,232.08 70.84,230.49 72.11,230.49 73.06,231.45 77.19,231.45 A23.S2 | v81.63,290.82 81.95,291.13 82.27,291.13 82.9,291.77 97.51,291.77 98.14,291.13 130.21,291.13 131.8,292.72 144.5,292.72 144.82,292.41 174.34,292.41 v174.66,292.72 | v173.71,218.11 178.47,213.35 178.47,211.12 180.69,211.12 181.33,210.49 184.5,210.49 185.14,209.86 201.33,209.86 v201.65,210.17 | v243.88,241.61 244.19,241.92 244.83,241.92 246.1,243.19 250.23,243.19 v251.81,244.78 | v261.66,252.4 261.97,252.08 264.83,252.08 v265.78,251.13 | v277.53,244.14 280.71,247.32 283.56,247.32 A07.L1
!76  (via drill 0.61)
  Top 0.254: 216.25,29.51 214.67,31.1 D12.R2 | 216.25,29.51 216.89,28.88 D12.S2 | v298.49,84.13 298.17,83.81 298.17,78.73 v299.12,77.77 | v304.52,72.69 305.15,72.06 305.15,67.3 304.84,66.98 v304.84,62.53 | v288.01,43.8 286.1,41.9 286.1,38.4 286.74,37.77 286.74,36.18 286.1,35.55 286.1,25.39 288.96,22.53 v288.96,4.75 | v273.4,4.12 266.74,4.12 263.88,1.26 213.4,1.26 213.4,18.09 213.08,18.4 213.08,26.34 216.25,29.51
  Route15 0.254: v298.49,84.13 291.82,90.79 291.82,92.7 290.87,93.65 290.87,94.6 C06.T2 | v299.12,77.77 299.44,77.77 v304.52,72.69
  Bottom 0.254: v304.84,62.53 299.44,57.14 299.44,55.23 v288.01,43.8 | v288.96,4.75 288.33,4.12 v273.4,4.12
!77  (via drill 0.61)
  Top 0.254: D12.T2 214.67,24.75 216.89,22.53 D12.U2 | v295.31,77.14 v295.31,84.13 | v299.76,58.72 299.44,58.41 299.44,55.23 298.8,54.6 298.8,50.79 301.66,47.93 301.66,47.29 301.03,46.66 301.03,42.21 301.34,41.9 301.34,40.63 301.03,40.31 v301.03,39.04 | v267.69,16.18 267.37,16.5 v267.37,20.31 | v254.99,18.09 254.35,17.45 254.35,11.42 254.04,11.1 236.89,11.1 v236.89,14.59 | v226.1,14.91 225.78,15.23 v225.78,24.12
  Route15 0.254: v292.77,87.94 293.72,86.98 293.72,85.71 v295.31,84.13 | v295.31,77.14 295.31,67.3 298.17,64.44 298.17,62.53 298.49,62.22 298.49,60 v299.76,58.72 | v225.78,24.12 222.92,24.12 v221.65,22.85
  Bottom 0.254: v292.77,87.94 292.45,88.25 291.5,88.25 291.18,88.57 C06.V2 | v301.03,39.04 294.99,33.01 291.18,33.01 290.87,33.32 290.23,33.32 288.33,31.42 288.33,29.51 288.64,29.2 288.64,26.34 282.29,19.99 282.29,17.13 273.72,17.13 272.77,16.18 v267.69,16.18 | v267.37,20.31 264.2,20.31 263.56,19.67 261.34,19.67 259.43,17.77 255.31,17.77 v254.99,18.09 | v236.89,14.59 236.26,15.23 226.41,15.23 v226.1,14.91 | v221.65,22.85 221.33,22.53 218.16,22.53 D12.U2
!ADDR_ACC  (via drill 0.61)
  Top 0.254: v258.16,162.23 v261.02,159.37
  Route2 0.254: v163.87,105.08 171.17,112.38 172.44,112.38 178.79,118.73 182.6,118.73 193.39,129.53 195.93,129.53 197.84,131.43 201.65,131.43 234.67,164.45 234.67,165.09 235.62,166.04 236.89,166.04 v241.97,171.12
  Route15 0.254: v246.42,173.02 254.04,165.4 254.04,165.09 254.67,164.45 255.94,164.45 v258.16,162.23
  Bottom 0.254: v163.87,105.08 161.01,105.08 C17.P1 | v241.97,171.12 242.92,172.07 244.83,172.07 245.78,173.02 v246.42,173.02 | v261.02,159.37 261.34,159.05 264.51,159.05 B08.T2
!B-BRK  (via drill 0.61)
  Top 0.254: v350.56,195.89 350.56,199.38 B02.C1 | v332.46,153.98 v332.46,146.67
  Bottom 0.254: 347.06,168.58 346.11,169.53 344.84,169.53 344.84,173.98 B02.M2 344.84,175.25 344.84,179.69 345.16,179.69 346.11,180.64 346.11,183.82 347.06,183.82 B02.J1 347.38,184.77 347.38,189.22 343.57,189.22 | 347.06,168.58 350.24,168.58 B02.P1 | 343.57,189.22 342.94,189.22 341.98,190.17 B02.F2 | v350.56,195.89 347.7,193.03 347.38,193.03 343.57,189.22 | v332.46,146.67 332.14,146.36 245.46,146.36 241.97,149.85 240.07,149.85 240.07,151.75 B10.V2 | v332.46,153.98 335,156.52 336.59,156.52 338.81,158.74 | 338.81,158.74 B02.T2 | 347.06,168.58 347.06,166.99 346.11,166.99 345.79,166.68 345.79,164.45 344.52,164.45 338.81,158.74
!BAC_00  (via drill 0.61)
  Top 0.254: v237.84,12.05 237.84,26.34 241.02,29.51 241.02,44.12 241.65,44.75 241.65,49.2 245.78,53.33 245.78,56.5 D10.F1 | v113.38,12.37 111.48,14.27 111.48,161.91 114.02,164.45 114.02,200.65 122.91,209.54 v122.91,210.17 | v144.18,214.93 145.77,216.52 v145.77,252.08 | v259.12,255.58 260.07,256.53 260.07,266.05 v260.39,266.37 | v280.71,267.96 279.75,267 279.75,255.58 | 279.75,255.58 279.75,241.61 279.12,240.97 279.12,236.84 v278.8,236.52 | v294.36,223.19 294.68,222.87 294.68,207.31 295.31,206.68 v295.31,205.41 | v338.49,140.01 338.49,141.27 339.44,142.23 339.44,153.34 v339.13,153.66 | v359.76,160.64 359.13,161.28 359.13,167.63 v359.76,168.26 | v342.62,207.63 341.98,208.27 341.98,217.79 v342.94,218.74 | v353.73,218.74 355.32,220.33 355.32,246.37 v355.64,246.68 | v281.34,255.58 279.75,255.58
  Route15 0.254: v341.67,156.2 v339.13,153.66 | v348.02,200.96 342.94,206.05 342.94,207.31 v342.62,207.63
  Bottom 0.254: v237.84,12.05 221.02,12.05 220.38,11.42 115.61,11.42 114.65,12.37 v113.38,12.37 | v122.91,210.17 127.67,214.93 v144.18,214.93 | v145.77,252.08 186.41,252.08 188.95,249.54 199.11,249.54 199.74,250.18 199.74,254.62 199.11,255.26 199.11,255.89 199.74,256.53 203.55,256.53 204.19,255.89 251.81,255.89 252.45,255.26 258.8,255.26 v259.12,255.58 | v260.39,266.37 261.34,267.32 263.88,267.32 264.51,267.96 273.09,267.96 273.72,267.32 276.58,267.32 277.21,267.96 v280.71,267.96 | v278.8,236.52 279.12,236.21 285.15,236.21 291.18,230.18 297.22,230.18 298.49,228.9 298.49,226.68 297.85,226.68 v294.36,223.19 | v295.31,205.41 296.9,207 299.76,207 B06.A1 | v338.49,140.01 335.63,140.01 C03.B1 | v341.67,156.2 342.62,157.15 354.37,157.15 356.91,159.69 358.81,159.69 v359.76,160.64 | v359.76,168.26 359.76,170.17 358.81,171.12 358.81,182.23 358.49,182.55 358.49,186.68 359.13,187.31 359.13,191.12 357.86,191.12 355.95,193.03 355.95,198.43 355,198.43 352.14,201.28 348.33,201.28 v348.02,200.96 | v342.94,218.74 343.25,219.06 353.41,219.06 v353.73,218.74 | v355.64,246.68 355.64,249.23 349.92,249.23 346.75,252.4 339.76,252.4 336.9,255.26 329.28,255.26 328.97,255.58 306.74,255.58 306.42,255.89 281.66,255.89 v281.34,255.58
!BAC_01  (via drill 0.61)
  Top 0.254: v127.67,14.27 126.72,15.23 126.72,64.76 124.18,67.3 124.18,75.87 124.5,76.19 v124.5,85.71 | v114.97,86.66 114.65,86.98 114.65,146.67 114.97,146.99 114.97,154.61 114.65,154.93 114.65,156.2 v115.61,157.15 | v159.42,159.05 159.1,159.37 159.1,164.14 159.74,164.77 159.74,166.99 159.1,167.63 159.1,207 159.42,207.31 159.42,224.46 159.1,224.78 159.1,226.05 159.42,226.36 159.42,230.81 158.47,231.76 158.47,263.51 v161.33,266.37 | v228,268.28 228.64,268.91 228.64,276.53 231.18,279.07 231.18,296.53 231.81,297.17 240.07,297.17 240.07,286.05 v240.7,285.42 | v303.25,283.2 304.84,281.61 304.84,254.94 308.01,251.77 v308.01,230.18 | v300.71,229.86 299.76,228.9 v299.76,227.32 | v297.85,225.09 298.17,224.78 298.17,211.76 v299.12,210.81 | v302.61,206.36 v302.61,210.17 | v300.71,204.46 299.76,203.51 v299.76,202.24 | v297.22,199.7 297.22,197.47 B06.D1 | D10.H1 248.96,53.33 248,52.38 248,31.74 250.54,29.2 250.54,18.72 v249.27,17.45 249.59,17.13 v249.59,13.32 | v337.86,127.3 337.86,129.53 C03.E1 | v311.5,84.76 v311.5,87.94 | v310.23,77.46 310.23,75.55 309.6,74.92 v309.6,73.97 | v297.53,68.25 297.85,67.93 297.85,64.44 298.17,64.12 298.17,62.53 v297.53,61.9 | v294.36,58.72 294.68,58.41 294.68,54.92 295.63,53.96 295.63,48.57 298.17,46.03 298.17,38.72 298.49,38.4 298.49,23.48 294.04,19.04 v294.04,13.96
  Route2 0.254: v354.37,115.88 356.59,113.65 347.38,104.44 347.38,103.18 v338.17,93.97
  Route15 0.254: v337.86,127.3 341.35,123.81 v341.67,123.81 | v349.92,120.96 v348.02,122.86
  Bottom 0.254: v249.27,17.45 248.96,17.13 223.24,17.13 222.92,17.45 221.97,17.45 218.48,13.96 127.99,13.96 v127.67,14.27 | v124.5,85.71 123.54,86.66 v114.97,86.66 | v115.61,157.15 115.92,156.83 157.2,156.83 v159.42,159.05 | v161.33,266.37 162.91,267.96 171.49,267.96 172.12,267.32 174.98,267.32 175.61,267.96 184.19,267.96 184.82,267.32 187.68,267.32 188.31,267.96 222.29,267.96 222.92,267.32 225.78,267.32 226.73,268.28 v228,268.28 | v240.7,285.42 240.7,284.15 241.02,284.15 241.65,283.51 269.59,283.51 270.55,284.47 300.07,284.47 301.66,282.88 302.93,282.88 v303.25,283.2 | v308.01,230.18 307.69,229.86 v300.71,229.86 | v299.76,227.32 299.12,226.68 299.12,226.36 v297.85,225.09 | v299.12,210.81 299.76,210.17 v302.61,210.17 | v302.61,206.36 v300.71,204.46 | v299.76,202.24 v297.22,199.7 | v341.67,123.81 341.98,123.49 342.94,123.49 343.89,122.54 347.7,122.54 v348.02,122.86 | v349.92,120.96 352.46,118.41 352.46,115.88 v354.37,115.88 | v338.17,93.97 339.44,92.7 339.44,90.79 327.38,90.79 324.2,87.62 311.82,87.62 v311.5,87.94 | v311.5,84.76 311.5,78.41 311.19,78.41 v310.23,77.46 | v309.6,73.97 309.28,74.28 303.57,74.28 v297.53,68.25 | v294.36,58.72 v297.53,61.9 | v294.04,13.96 293.72,13.64 292.14,13.64 291.5,13.01 271.82,13.01 271.5,12.69 250.23,12.69 v249.59,13.32
!BAC_02  (via drill 0.61)
  Top 0.254: v247.37,30.15 247.37,49.2 246.42,50.15 D10.J1 | v284.2,23.16 286.74,20.62 v286.74,16.18 | v359.76,16.5 362.3,19.04 362.3,50.79 v362.62,51.1 | v363.57,81.9 v363.57,78.41 | v361.03,84.44 358.49,86.98 358.49,100 357.54,100.95 v357.54,103.18 | v348.33,104.13 347.7,104.76 v347.7,106.03 | v337.86,112.7 339.44,114.29 339.44,121.27 338.49,122.22 338.49,123.18 C03.H1
  Route2 0.254: 338.49,107.94 338.49,108.57 336.59,110.48 336.9,110.8 336.9,111.75 v337.86,112.7 | 338.49,107.94 v338.49,106.99 | v299.76,190.8 299.76,189.54 303.25,186.04 301.98,184.77 301.98,183.5 308.96,176.52 318.49,176.52 319.12,177.15 320.39,177.15 326.43,171.12 331.19,175.88 334.05,175.88 334.68,176.52 336.9,176.52 341.67,181.28 342.3,181.28 344.52,183.5 346.11,183.5 348.02,181.6 350.24,183.82 350.87,183.82 357.22,177.47 356.91,177.15 356.91,176.52 357.54,175.88 359.13,175.88 370.88,164.14 370.88,159.05 369.61,157.79 369.61,154.29 362.94,147.62 362.94,146.99 359.76,143.81 359.76,142.55 357.86,140.64 357.86,139.05 355.64,136.83 355.64,130.48 352.46,127.3 352.46,126.99 350.87,125.4 349.29,125.4 347.06,123.18 347.06,121.91 343.25,118.1 343.25,112.7 338.49,107.94
  Route15 0.254: v280.71,26.66 v278.17,29.2 | v354.37,59.36 v362.62,51.1
  Bottom 0.254: v247.37,30.15 247.69,29.83 258.8,29.83 261.34,27.29 263.88,27.29 265.78,29.2 267.05,29.2 267.69,29.83 277.53,29.83 v278.17,29.2 | v280.71,26.66 281.02,26.98 284.52,26.98 285.79,25.71 285.79,24.44 285.47,24.44 v284.2,23.16 | v286.74,16.18 287.06,16.5 v359.76,16.5 | v354.37,59.36 354.68,59.04 364.53,59.04 369.61,64.12 369.61,78.41 v363.57,78.41 | v361.03,84.44 v363.57,81.9 | v357.54,103.18 357.22,103.49 355.95,103.49 355.64,103.81 351.83,103.81 351.51,103.49 348.97,103.49 v348.33,104.13 | v347.7,106.03 347.38,106.35 339.13,106.35 v338.49,106.99 | v299.76,190.8 297.53,190.8 B06.F1
!BAC_03  (via drill 0.61)
  Top 0.254: v243.88,46.03 241.65,43.8 241.65,29.2 238.48,26.02 238.48,15.23 v238.8,14.91 | v340.08,14.59 358.81,14.59 358.81,39.68 359.76,40.63 359.76,43.17 359.13,43.8 359.13,67.3 359.45,67.61 359.45,68.57 355.32,72.69 v355.32,73.33 | v349.29,79.36 348.97,79.68 348.97,90.47 347.7,91.74 v347.7,93.33 | v315.63,166.99 316.58,167.95 v316.58,168.58 | v337.54,146.99 v337.54,152.39 | v335.63,142.23 v335.63,146.67 | v350.24,140.96 349.92,140.64 349.92,137.46 349.6,137.15 349.6,129.21 v350.24,128.58
  Route2 0.254: v355.32,73.33 v349.29,79.36 | v343.57,126.99 339.13,122.54 339.13,118.73 338.49,118.1 C03.K1
  Route15 0.254: v347.7,93.33 346.11,94.92 346.11,100.32 345.79,100.63 345.79,101.59 343.25,104.13 343.25,108.25 340.08,111.43 340.08,115.24 338.49,116.83 C03.K1 | v300.71,184.14 307.06,177.79 307.06,175.88 310.87,172.07 310.87,171.12 v311.19,170.8 | v337.54,152.39 v322.62,167.31
  Bottom 0.254: v243.88,46.03 244.19,46.34 247.69,46.34 248.64,47.29 D10.K1 | v238.8,14.91 239.11,15.23 255.94,15.23 257.85,13.32 271.18,13.32 271.5,13.64 291.18,13.64 292.45,14.91 339.76,14.91 v340.08,14.59 | v311.19,170.8 312.14,169.85 313.09,169.85 315.63,167.31 v315.63,166.99 | v316.58,168.58 318.17,166.99 319.76,166.99 320.08,167.31 v322.62,167.31 | v337.54,146.99 337.22,146.67 v335.63,146.67 | v335.63,142.23 336.27,141.59 338.81,141.59 339.13,141.91 343.57,141.91 344.52,140.96 v350.24,140.96 | v350.24,128.58 349.92,128.26 344.84,128.26 v343.57,126.99 | v300.71,184.14 B06.J1
!BAC_04  (via drill 0.61)
  Top 0.254: v271.5,52.38 274.36,52.38 v274.36,49.2 | v318.49,63.49 318.17,63.81 318.17,65.71 317.54,66.35 317.54,68.57 318.81,69.84 v318.81,70.16 | v330.55,81.9 330.55,90.16 329.92,90.79 329.92,95.87 327.7,98.1 327.7,100.63 327.38,100.95 327.38,116.19 v328.97,117.78 | v297.22,173.02 297.22,177.15 B06.L1 | v302.3,162.86 301.98,162.55 301.98,158.1 303.57,156.52 v303.57,155.24 | v306.42,152.39 306.74,152.07 306.74,150.17 306.42,149.85 306.42,146.04 v307.69,144.77
  Route2 0.254: v246.1,47.29 v254.67,55.87 | v268.64,52.06 271.18,52.06 v271.5,52.38 | v315.63,59.36 315.63,60.63 v318.49,63.49 | v297.22,173.02 298.8,171.44 296.9,169.53 296.9,168.26 v302.3,162.86 | v306.42,152.39 v303.57,155.24
  Route15 0.254: v259.12,54.28 259.12,53.33 v261.66,50.79 | v287.69,49.83 288.33,49.83 v294.68,43.49 | v318.81,70.16 323.25,74.6 324.52,74.6 326.74,76.82 v326.11,77.46 | v335.32,117.78 336.27,116.83 336.27,112.7 337.54,111.43 C03.M1 | v307.69,144.77 310.87,141.59 310.87,140.96 321.66,130.16 321.66,129.53 326.74,124.45 326.74,120.96 327.06,120.64 327.06,119.69 v328.97,117.78
  Bottom 0.254: v246.1,47.29 243.56,47.29 D10.K2 | v254.67,55.87 255.31,55.23 258.16,55.23 v259.12,54.28 | v261.66,50.79 262.93,52.06 v268.64,52.06 | v274.36,49.2 274.67,48.88 284.52,48.88 285.47,49.83 v287.69,49.83 | v294.68,43.49 294.99,43.17 298.8,43.17 315,59.36 v315.63,59.36 | v326.11,77.46 v330.55,81.9 | v328.97,117.78 329.92,118.73 334.36,118.73 v335.32,117.78
!BAC_05  (via drill 0.61)
  Top 0.254: v297.85,160.33 297.85,161.59 295.63,163.82 295.63,169.85 296.58,170.8 B06.N1 | v296.26,143.18 v296.26,148.89
  Route15 0.254: v297.85,160.33 297.85,159.69 298.49,159.05 298.49,157.47 298.8,157.15 298.8,152.07 295.95,149.21 v296.26,148.89 | v303.88,141.59 304.52,141.59 306.74,139.37 306.74,138.42 336.27,108.89 336.27,106.99 337.86,105.4 C03.P1
  Bottom 0.254: v296.26,143.18 297.22,142.23 298.8,142.23 299.44,141.59 v303.88,141.59
!BAC_06  (via drill 0.61)
  Top 0.254: v335.95,98.73 336.27,99.05 336.27,103.18 v334.36,105.08 | v297.85,162.86 297.22,163.5 297.22,164.45 B06.R1
  Route15 0.254: v334.36,105.08 322.62,116.83 322.62,117.14 321.98,117.78 321.03,117.78 299.76,139.05 299.76,141.27 298.8,142.23 298.8,151.12 302.61,154.93 302.61,156.52 v299.76,159.37
  Bottom 0.254: v335.95,98.73 337.54,98.73 C03.S1 | v299.76,159.37 301.34,160.96 301.34,163.18 298.17,163.18 v297.85,162.86
!BAC_07  (via drill 0.61)
  Top 0.254: v325.16,101.27 324.2,102.22 324.2,107.62 v324.84,108.25 | v308.33,124.77 306.74,126.35 306.74,128.26 306.11,128.89 305.15,128.89 305.15,134.61 v305.47,134.93 | v297.22,141.27 297.22,151.75 B06.V1
  Route15 0.254: v325.16,101.27 v334.36,92.06 | v324.84,108.25 322.93,110.16 322.93,110.8 316.9,116.83 316.27,116.83 v308.33,124.77 | v305.47,134.93 305.15,134.93 v300.71,139.37
  Bottom 0.254: v300.71,139.37 298.8,141.27 v297.22,141.27 | v334.36,92.06 C03.U1
!BAC_08  (via drill 0.61)
  Top 0.254: v327.7,142.55 327.38,142.23 327.38,132.7 327.7,132.39 327.7,128.26 328.33,127.62 C03.F2 | v319.12,166.04 319.44,166.36 319.44,166.68 320.39,167.63 320.39,171.44 317.54,174.3 v317.54,174.93 | v299.76,195.25 299.76,199.38 B06.C1
  Route15 0.254: v327.7,142.55 327.7,151.43 327.38,151.75 327.38,157.79 v319.12,166.04 | v317.54,174.93 317.54,179.37 310.23,186.68 309.92,186.68 302.61,193.98 v302.61,194.3
  Bottom 0.254: v302.61,194.3 301.66,195.25 v299.76,195.25
!BAC_09  (via drill 0.61)
  Top 0.254: v294.04,179.37 294.99,180.33 294.99,192.08 294.04,193.03 B06.E2 | v296.58,179.37 298.17,179.37 298.17,169.53 v297.85,169.21 | v328.01,124.13 328.33,123.81 328.33,121.27 C03.J2
  Route2 0.254: v296.58,179.37 v294.04,179.37 | v297.85,169.21 298.8,168.26 298.8,167.63 302.61,163.82 302.93,163.82 304.84,161.91 303.57,160.64 v303.57,160.33
  Route15 0.254: v303.57,160.33 311.19,152.71 311.19,150.8 312.46,149.53 312.46,146.67 319.44,139.69 319.44,138.1 326.74,130.8 326.74,125.4 v328.01,124.13
!BAC_10  (via drill 0.61)
  Top 0.254: v353.41,131.11 354.37,130.16 355.95,130.16 355.95,135.88 355.64,136.2 355.64,136.83 357.86,139.05 357.86,140.64 v360.72,143.5 | v364.21,157.15 363.57,157.79 v363.57,160.33 | v347.7,192.08 347.06,192.71 v347.06,193.98 | v348.97,210.81 348.97,212.39 349.6,213.03 349.6,222.24 348.97,222.87 v348.97,224.14 | v369.61,227 369.92,227.32 369.92,243.83 v368.02,245.73 | v366.11,247.32 366.43,247.64 v366.43,274.31 | v253.08,285.1 250.54,282.56 v250.54,267 | v294.04,189.85 294.04,187.95 B06.H2 | v328.01,212.71 v328.01,205.73
  Route2 0.254: v341.03,128.58 340.08,127.62 340.08,126.99 338.17,125.08 337.54,125.08 328.97,116.51 328.97,114.92 C03.L2 | v348.02,129.53 348.33,129.53 350.24,131.43 350.87,131.43 351.83,132.39 352.46,132.39 353.41,131.43 v353.41,131.11 | v344.52,198.11 342.3,200.33 343.57,201.6 343.57,203.51 346.11,206.05 346.11,207.95 v348.97,210.81 | v300.71,189.85 302.93,192.08 307.38,192.08 307.69,192.39 308.33,192.39 v318.17,202.24 | v328.01,205.73 v325.79,203.51
  Route15 0.254: v363.89,144.77 363.89,146.04 362.94,146.99 v362.94,151.12
  Bottom 0.254: v341.03,128.58 341.35,128.89 347.38,128.89 v348.02,129.53 | v360.72,143.5 361.99,144.77 v363.89,144.77 | v362.94,151.12 364.84,153.02 364.84,157.15 v364.21,157.15 | v363.57,160.33 363.26,160.64 362.94,160.64 361.67,161.91 361.67,163.82 355.95,163.82 355.64,164.14 355,164.14 354.68,163.82 347.06,163.82 346.43,164.45 346.43,166.36 348.33,166.36 348.97,166.99 357.86,166.99 358.49,167.63 358.49,170.49 357.86,170.49 348.97,179.37 348.97,192.08 v347.7,192.08 | v347.06,193.98 344.52,196.52 v344.52,198.11 | v348.97,224.14 348.97,226.68 352.46,226.68 353.1,226.05 355.95,226.05 356.91,227 v369.61,227 | v368.02,245.73 366.43,247.32 v366.11,247.32 | v366.43,274.31 366.43,283.83 355,283.83 353.73,285.1 v253.08,285.1 | v250.54,267 250.23,267.32 247.37,267.32 246.73,267.96 244.19,267.96 242.92,266.69 A10.D2 | v294.04,189.85 294.68,189.22 300.07,189.22 v300.71,189.85 | v318.17,202.24 321.35,202.24 321.66,201.92 324.2,201.92 v325.79,203.51 | v328.01,212.71 328.33,212.39 349.29,212.39 349.6,212.71 350.24,212.71 350.87,212.08 350.87,210.81 v348.97,210.81
!BAC_11  (via drill 0.61)
  Top 0.254: v232.45,96.83 231.81,96.19 231.81,93.97 232.13,93.65 232.13,88.25 232.45,87.94 v232.45,81.58 | v253.08,74.6 254.35,74.6 255.94,76.19 259.12,76.19 259.12,76.5 v259.43,76.82 | v267.69,75.87 272.77,75.87 273.72,76.82 v274.67,76.82 | v254.99,153.98 256.26,152.71 v256.26,144.77 | v254.67,126.67 253.72,125.72 253.72,118.73 v252.13,117.14
  Route2 0.254: 233.4,99.68 234.35,98.73 v232.45,96.83 | 233.4,99.68 230.86,102.22 230.22,102.22 229.91,101.91 227.68,101.91 C11.R2 | v247.05,80.63 v253.08,74.6 | v299.12,82.22 299.12,82.86 304.52,88.25 304.52,92.06 319.76,107.3 v320.08,107.3 | v258.48,174.3 255.31,171.12 255.31,169.85 254.35,168.9 254.35,166.04 v254.99,165.4 | v252.13,117.14 239.75,104.76 238.48,104.76 233.4,99.68
  Route15 0.254: v286.42,178.11 285.79,178.11 284.83,179.06 283.25,179.06 v282.61,178.42 | v244.51,161.59 244.51,158.42 v246.1,156.83 | v256.26,144.77 256.26,144.13 260.07,140.32 260.07,130.16 v261.66,128.58
  Bottom 0.254: v232.45,81.58 233.08,80.95 246.73,80.95 v247.05,80.63 | v259.43,76.82 259.75,77.14 266.42,77.14 v267.69,75.87 | v274.67,76.82 279.75,76.82 280.71,77.77 294.68,77.77 v299.12,82.22 | v320.08,107.3 320.71,106.67 327.06,106.67 328.01,107.62 C03.N2 | v286.42,178.11 286.74,178.11 287.69,179.06 291.5,179.06 293.09,180.64 B06.K2 | v282.61,178.42 281.98,179.06 275.31,179.06 272.13,175.88 260.07,175.88 v258.48,174.3 | v254.99,165.4 253.4,163.82 249.91,163.82 249.27,164.45 247.37,164.45 v244.51,161.59 | v246.1,156.83 250.86,156.83 253.72,153.98 v254.99,153.98 | v261.66,128.58 259.75,130.48 258.48,130.48 v254.67,126.67
!BLK_IN_SYNC  (via drill 0.61)
  Top 0.254: v238.8,54.28 238.8,52.06 239.43,51.42 D10.J2 | v203.55,52.69 200.38,55.87 200.38,77.46 200.7,77.77 200.7,78.73 199.11,80.32 v199.11,89.21 | v247.69,270.18 248.64,271.13 248.64,275.26 248.96,275.58 A10.A1 | v203.24,260.66 v203.24,262.56 | v197.52,259.38 193.71,255.58 v193.71,253.67 | v183.23,243.83 183.87,243.19 183.87,239.38 182.92,238.43 182.92,236.52 183.87,235.57 183.87,232.71 v181.96,230.81 | v180.06,230.18 180.38,229.86 180.38,226.36 180.69,226.05 180.69,218.11 181.33,217.48 v181.33,213.03 | v172.76,203.51 171.8,202.55 171.8,198.74 v173.39,197.15 | v170.85,193.34 171.17,193.03 171.17,189.54 170.22,188.58 v170.22,188.27 | v178.79,159.69 178.15,159.05 178.15,154.61 178.47,154.29 178.47,153.34 177.52,152.39 177.52,151.12 175.93,149.53 175.93,143.5 v176.25,143.18
  Route2 0.254: v199.11,89.21 205.14,95.24 205.14,96.83 206.09,97.78 206.09,99.36 207.68,100.95 C13.R1 | v247.69,270.18 245.78,270.18 236.57,260.97 234.67,260.97 233.4,262.24 v230.54,259.38 | v193.71,253.67 193.08,253.67 v183.23,243.83 | v181.33,213.03 178.79,210.49 178.47,210.49 174.98,207 174.98,205.73 v172.76,203.51 | v173.39,197.15 173.39,195.89 v170.85,193.34 | v170.22,188.27 172.76,185.73 171.49,184.46 171.49,181.6 171.8,181.28 171.8,175.56 170.22,173.98 170.22,173.02 171.49,171.76 171.49,171.12 170.53,170.17 170.53,168.58 179.11,160.01 v178.79,159.69
  Route15 0.254: v218.48,261.29 217.21,261.29 v214.67,263.83 | v176.25,143.18 176.57,143.18 181.96,137.78 181.96,137.46 182.6,136.83 183.23,136.83 205.78,114.29 205.78,112.07 206.09,111.75 206.09,103.81 207.68,102.22 C13.R1
  Bottom 0.254: v238.8,54.28 237.21,52.69 v203.55,52.69 | v230.54,259.38 230.22,259.07 224.83,259.07 222.29,261.61 218.79,261.61 v218.48,261.29 | v214.67,263.83 213.08,262.24 209.9,262.24 209.59,262.56 205.78,262.56 205.46,262.24 203.55,262.24 v203.24,262.56 | v203.24,260.66 203.24,259.07 197.84,259.07 v197.52,259.38 | v181.96,230.81 181.33,230.18 v180.06,230.18
!BMB_00  (via drill 0.61)
  Top 0.254: v300.71,148.58 300.71,143.81 300.39,143.5 C06.A1 | v347.06,149.21 346.75,148.89 346.75,140.96 347.38,140.32 C02.B1
  Bottom 0.254: v300.71,148.58 301.03,148.26 313.09,148.26 313.73,148.89 320.39,148.89 320.71,149.21 v347.06,149.21
!BMB_01  (via drill 0.61)
  Top 0.254: v297.22,136.83 297.22,133.97 C06.D1 | v305.47,138.74 306.42,139.69 306.42,140.96 308.65,143.18 308.65,150.17 v308.33,150.48 | v355.32,151.12 355.32,137.46 355,137.15 355,134.29 355.32,133.97 355.32,131.75 v354.68,131.11
  Bottom 0.254: v297.22,136.83 298.17,137.78 304.52,137.78 v305.47,138.74 | v308.33,150.48 308.65,150.17 319.76,150.17 320.39,150.8 355,150.8 v355.32,151.12 | v354.68,131.11 353.73,130.16 C02.E1
!BMB_02  (via drill 0.61)
  Top 0.254: v305.47,127.94 305.15,127.62 305.15,109.21 307.69,106.67 v307.69,103.49 | v355.32,102.86 v355.32,123.49
  Bottom 0.254: v305.47,127.94 305.15,128.26 298.49,128.26 297.53,127.3 C06.F1 | v307.69,103.49 310.55,103.49 311.19,102.86 v355.32,102.86 | v355.32,123.49 351.51,123.49 C02.H1
!BMB_03  (via drill 0.61)
  Top 0.254: v307.38,119.69 308.01,119.05 308.01,107.94 308.33,107.62 308.33,104.76 311.19,101.91 v311.19,100.95 | v339.13,100.95 339.44,101.27 339.44,112.38 v339.13,112.7 | v350.56,112.7 350.56,116.83 C02.K1
  Bottom 0.254: v307.38,119.69 307.06,119.37 298.49,119.37 297.53,120.32 C06.J1 | v311.19,100.95 311.82,100.32 338.49,100.32 v339.13,100.95 | v339.13,112.7 v350.56,112.7
!BMB_04  (via drill 0.61)
  Top 0.254: v300.39,106.67 v300.39,109.52 | v306.11,102.86 308.01,100.95 v308.01,97.78 | v320.71,97.14 320.39,97.46 320.39,103.81 v320.71,104.13 | v350.56,106.35 350.56,110.48 C02.M1